# EAGLE design Motor_Test_Bench_ONE_LAYER (EAGLE 9.5.0)
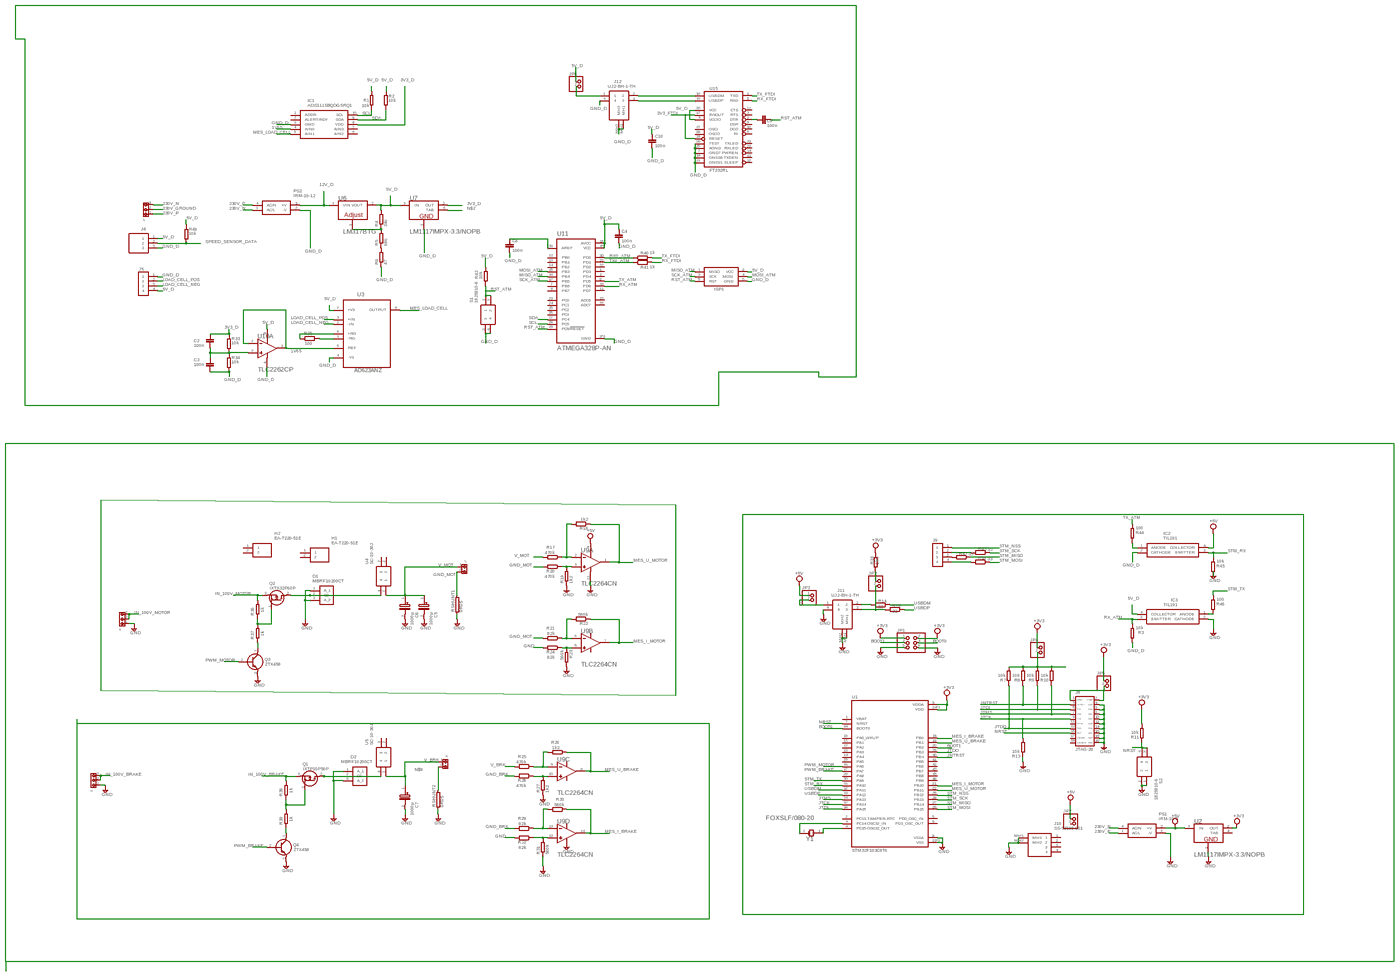
[diagram p0: schematic, sheet 1, overview]
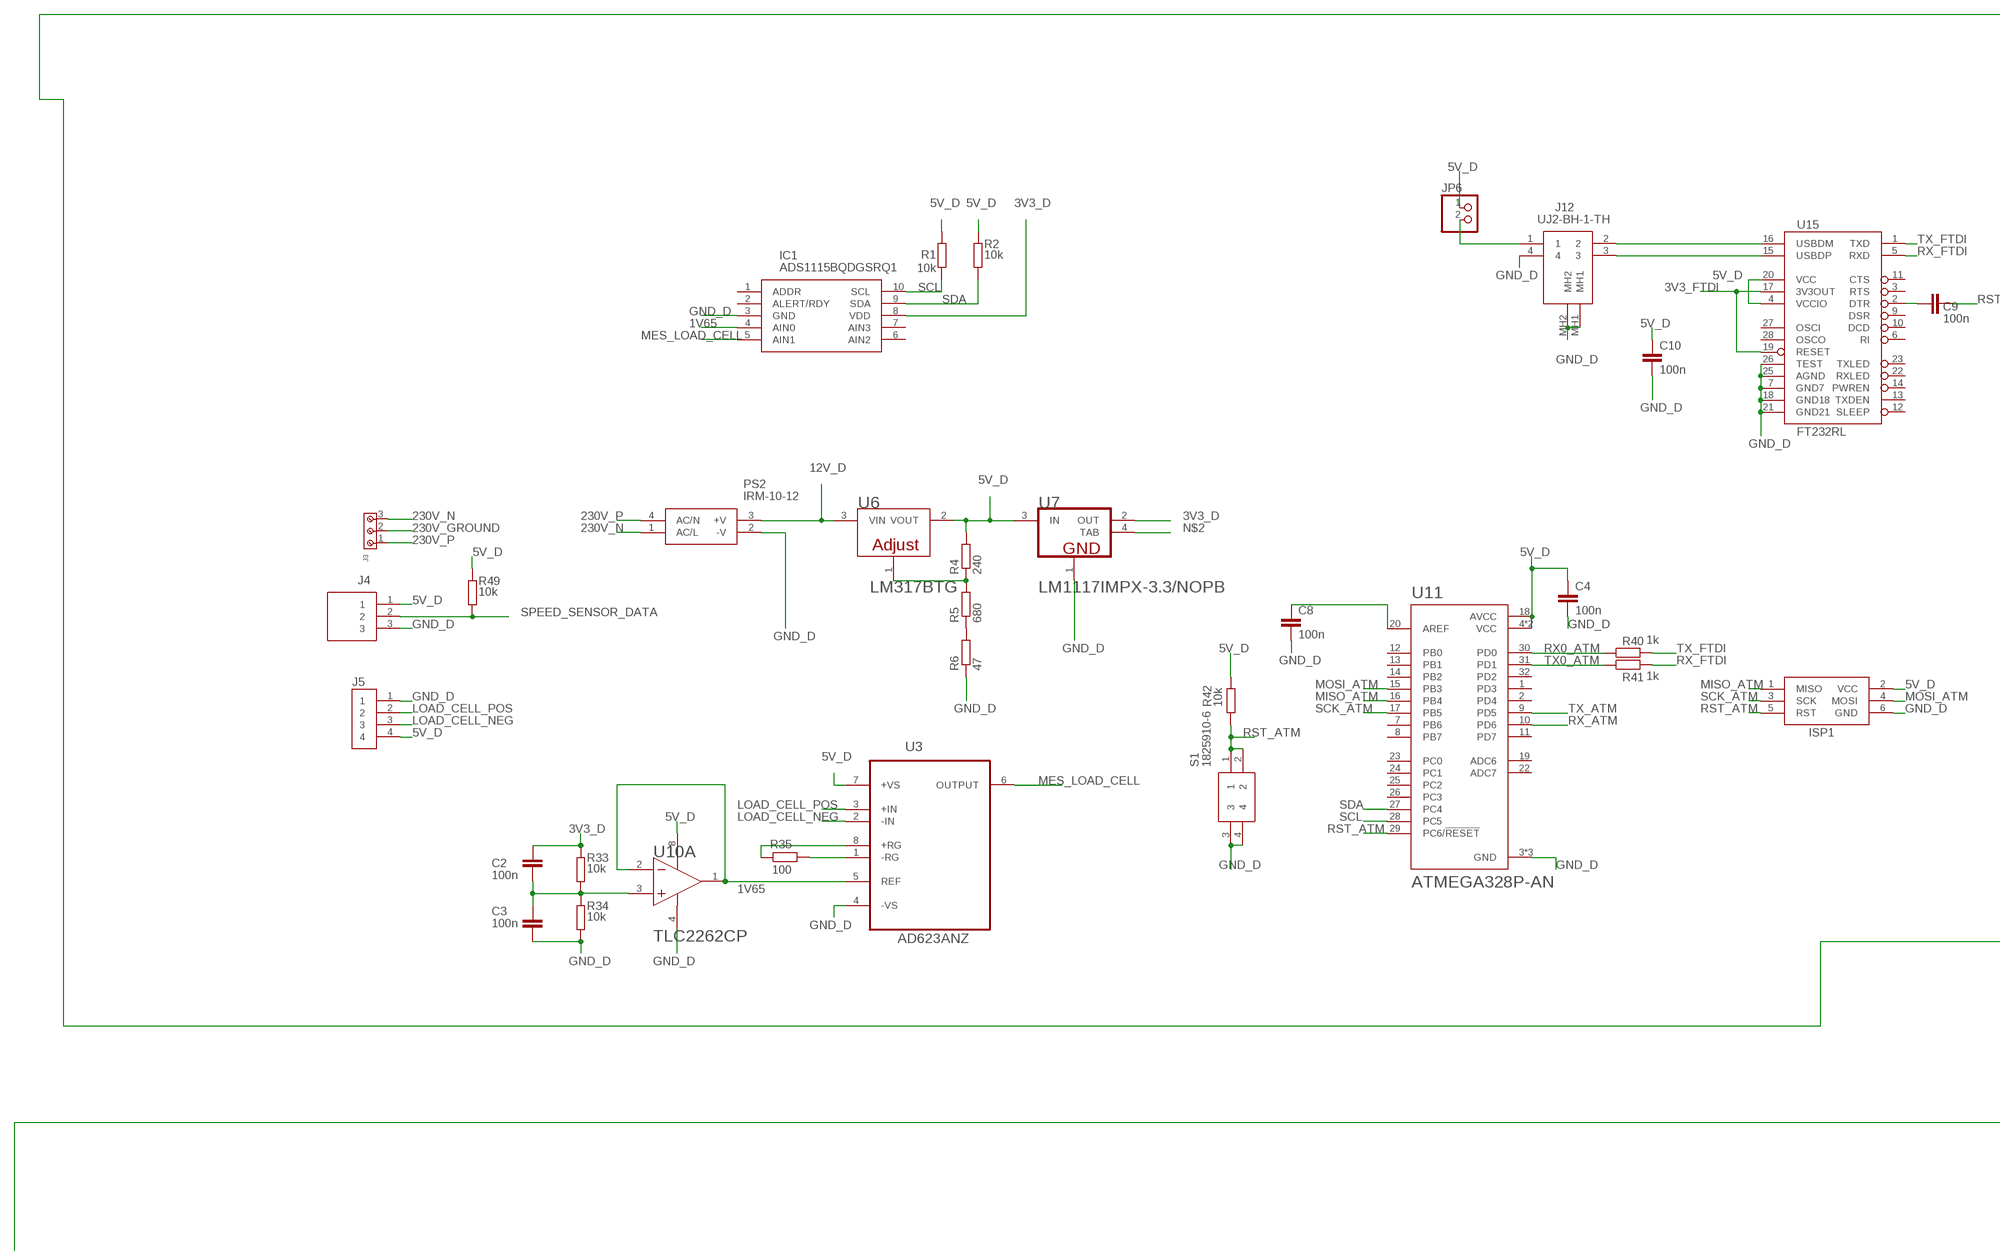
[diagram p1: schematic, sheet 1, part 1 of 4]
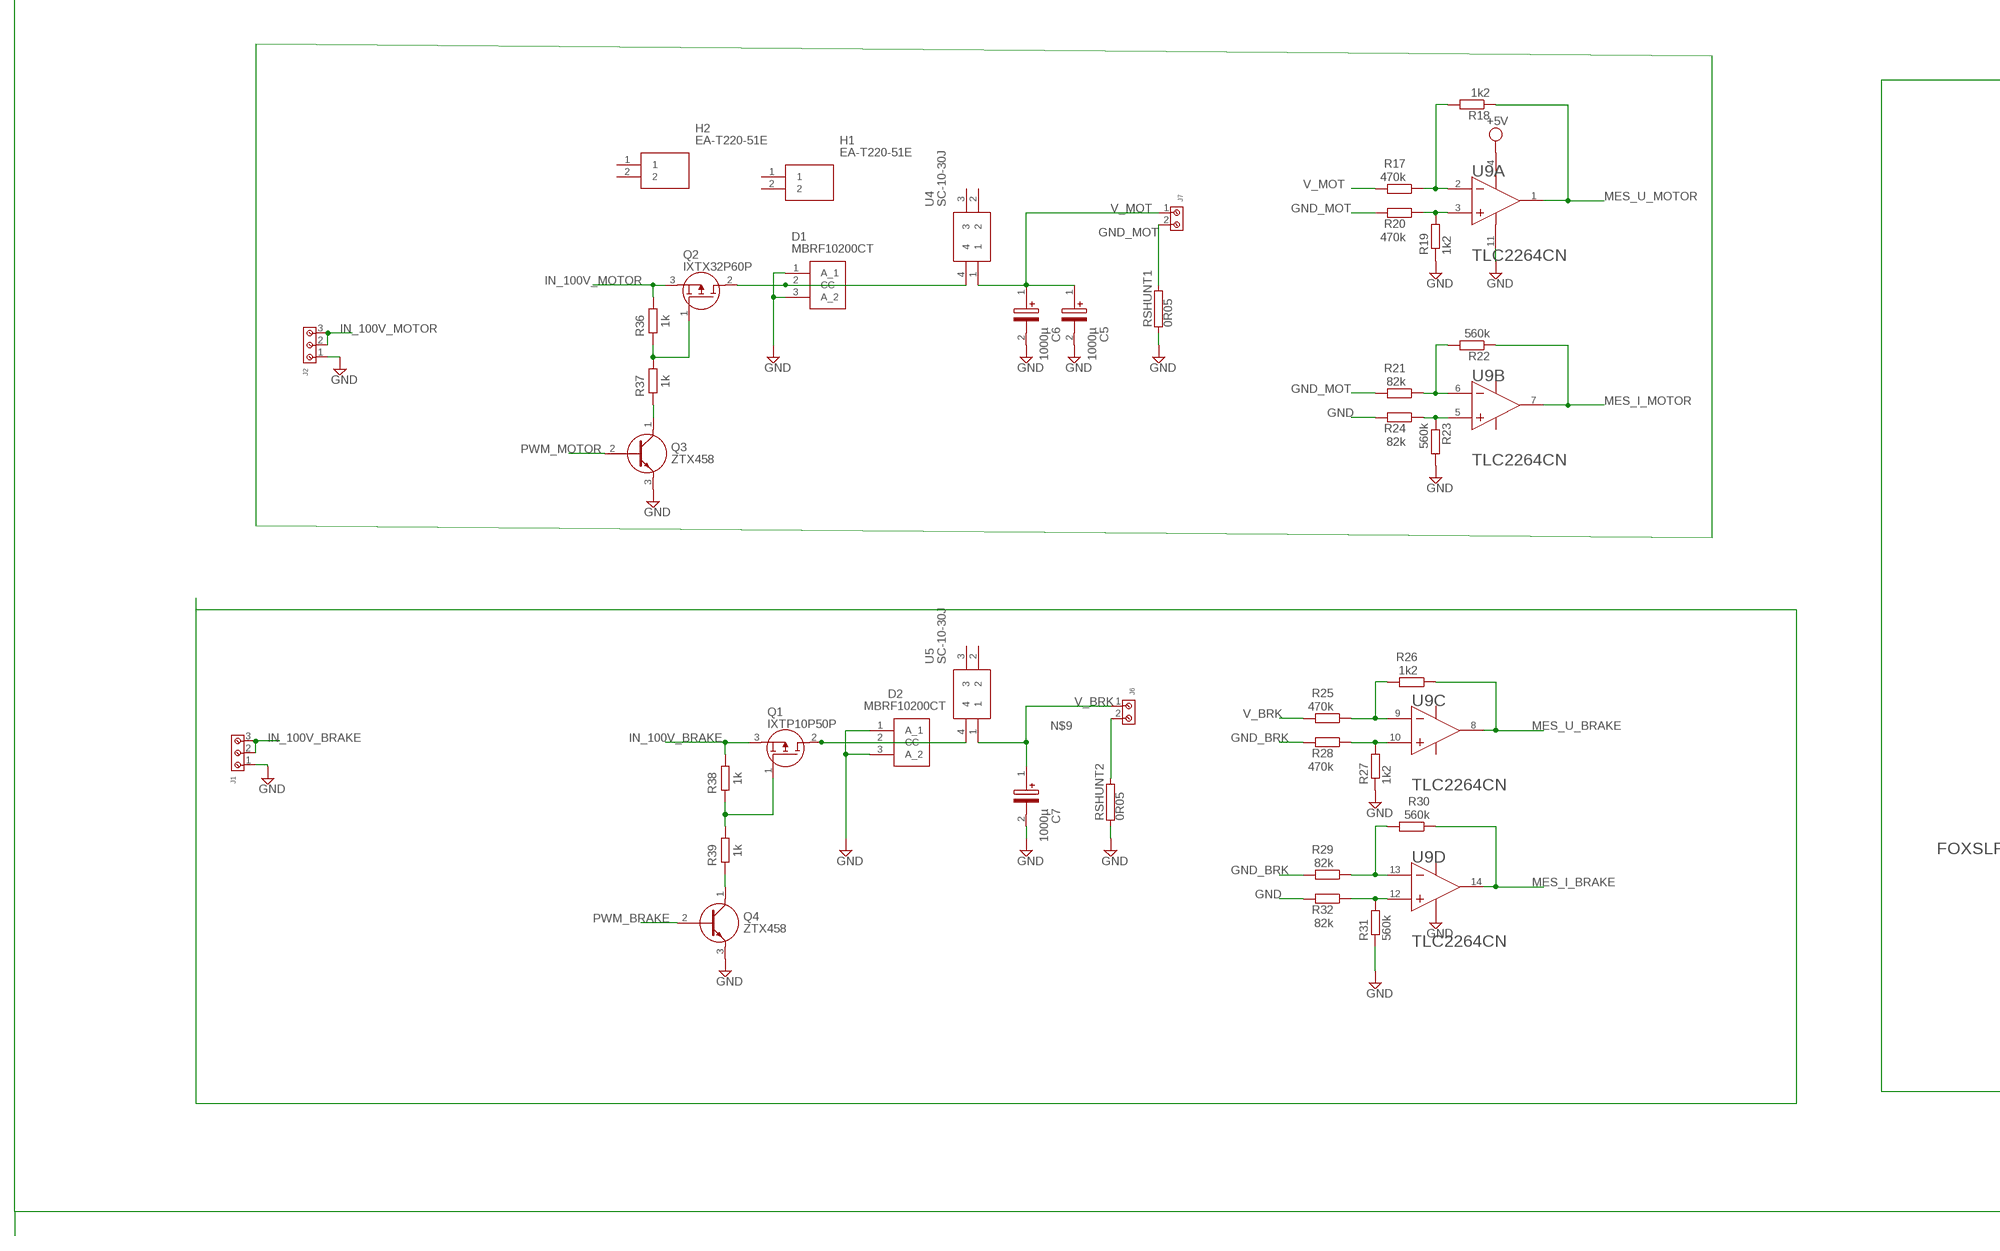
[diagram p2: schematic, sheet 1, part 2 of 4]
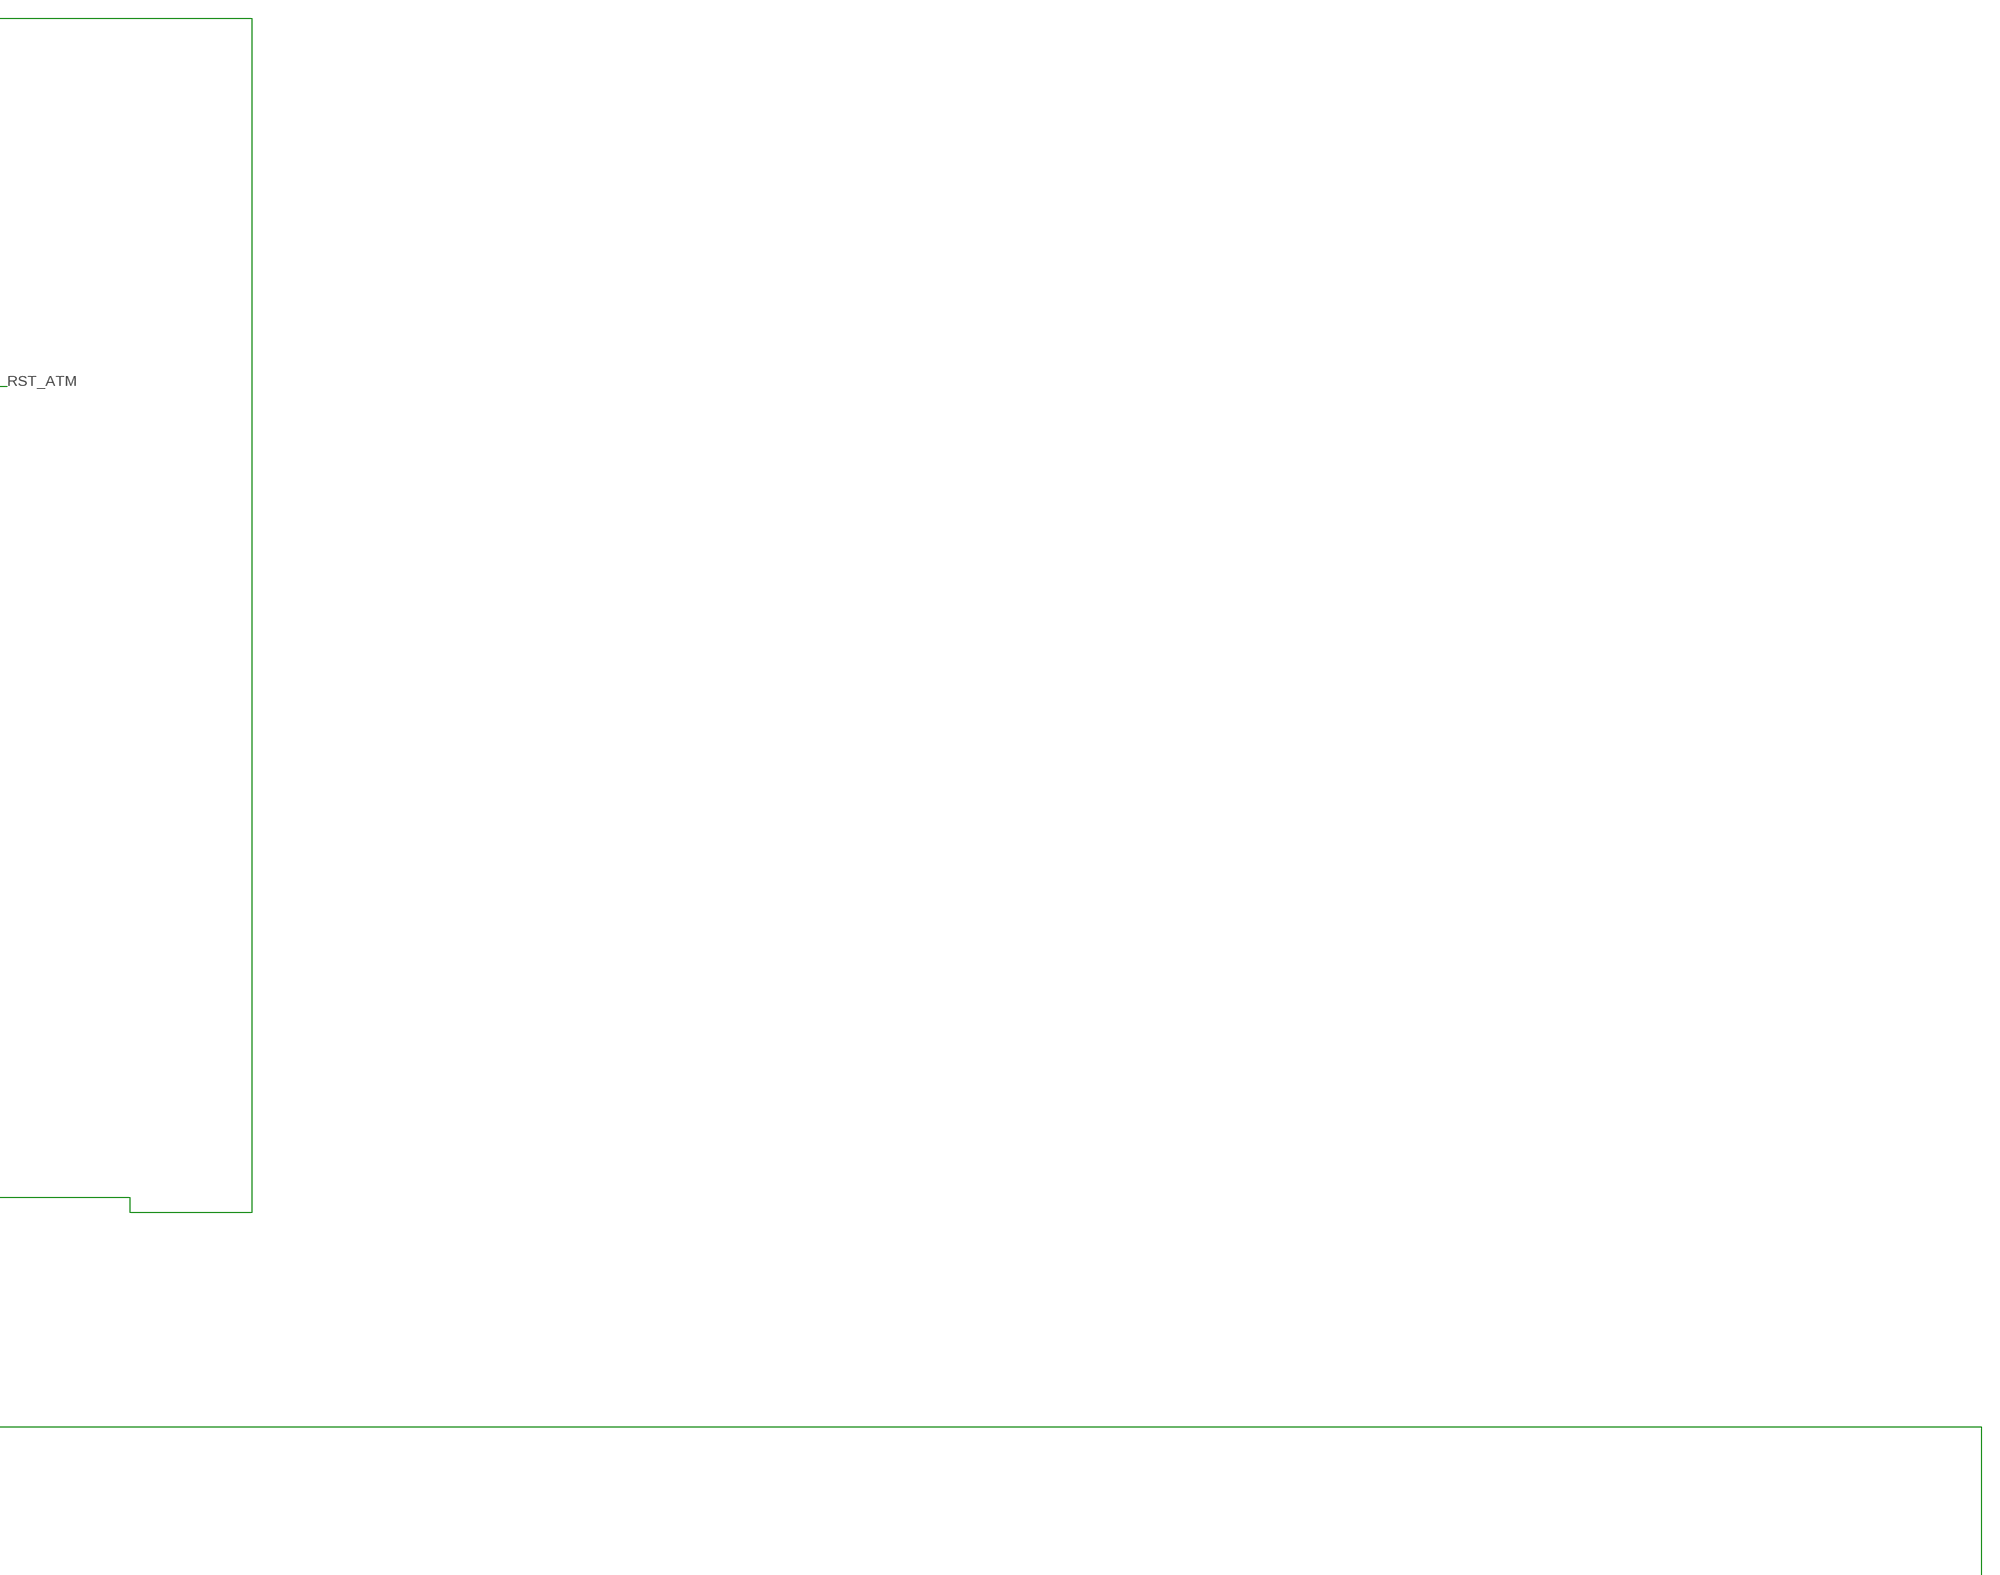
[diagram p3: schematic, sheet 1, part 3 of 4]
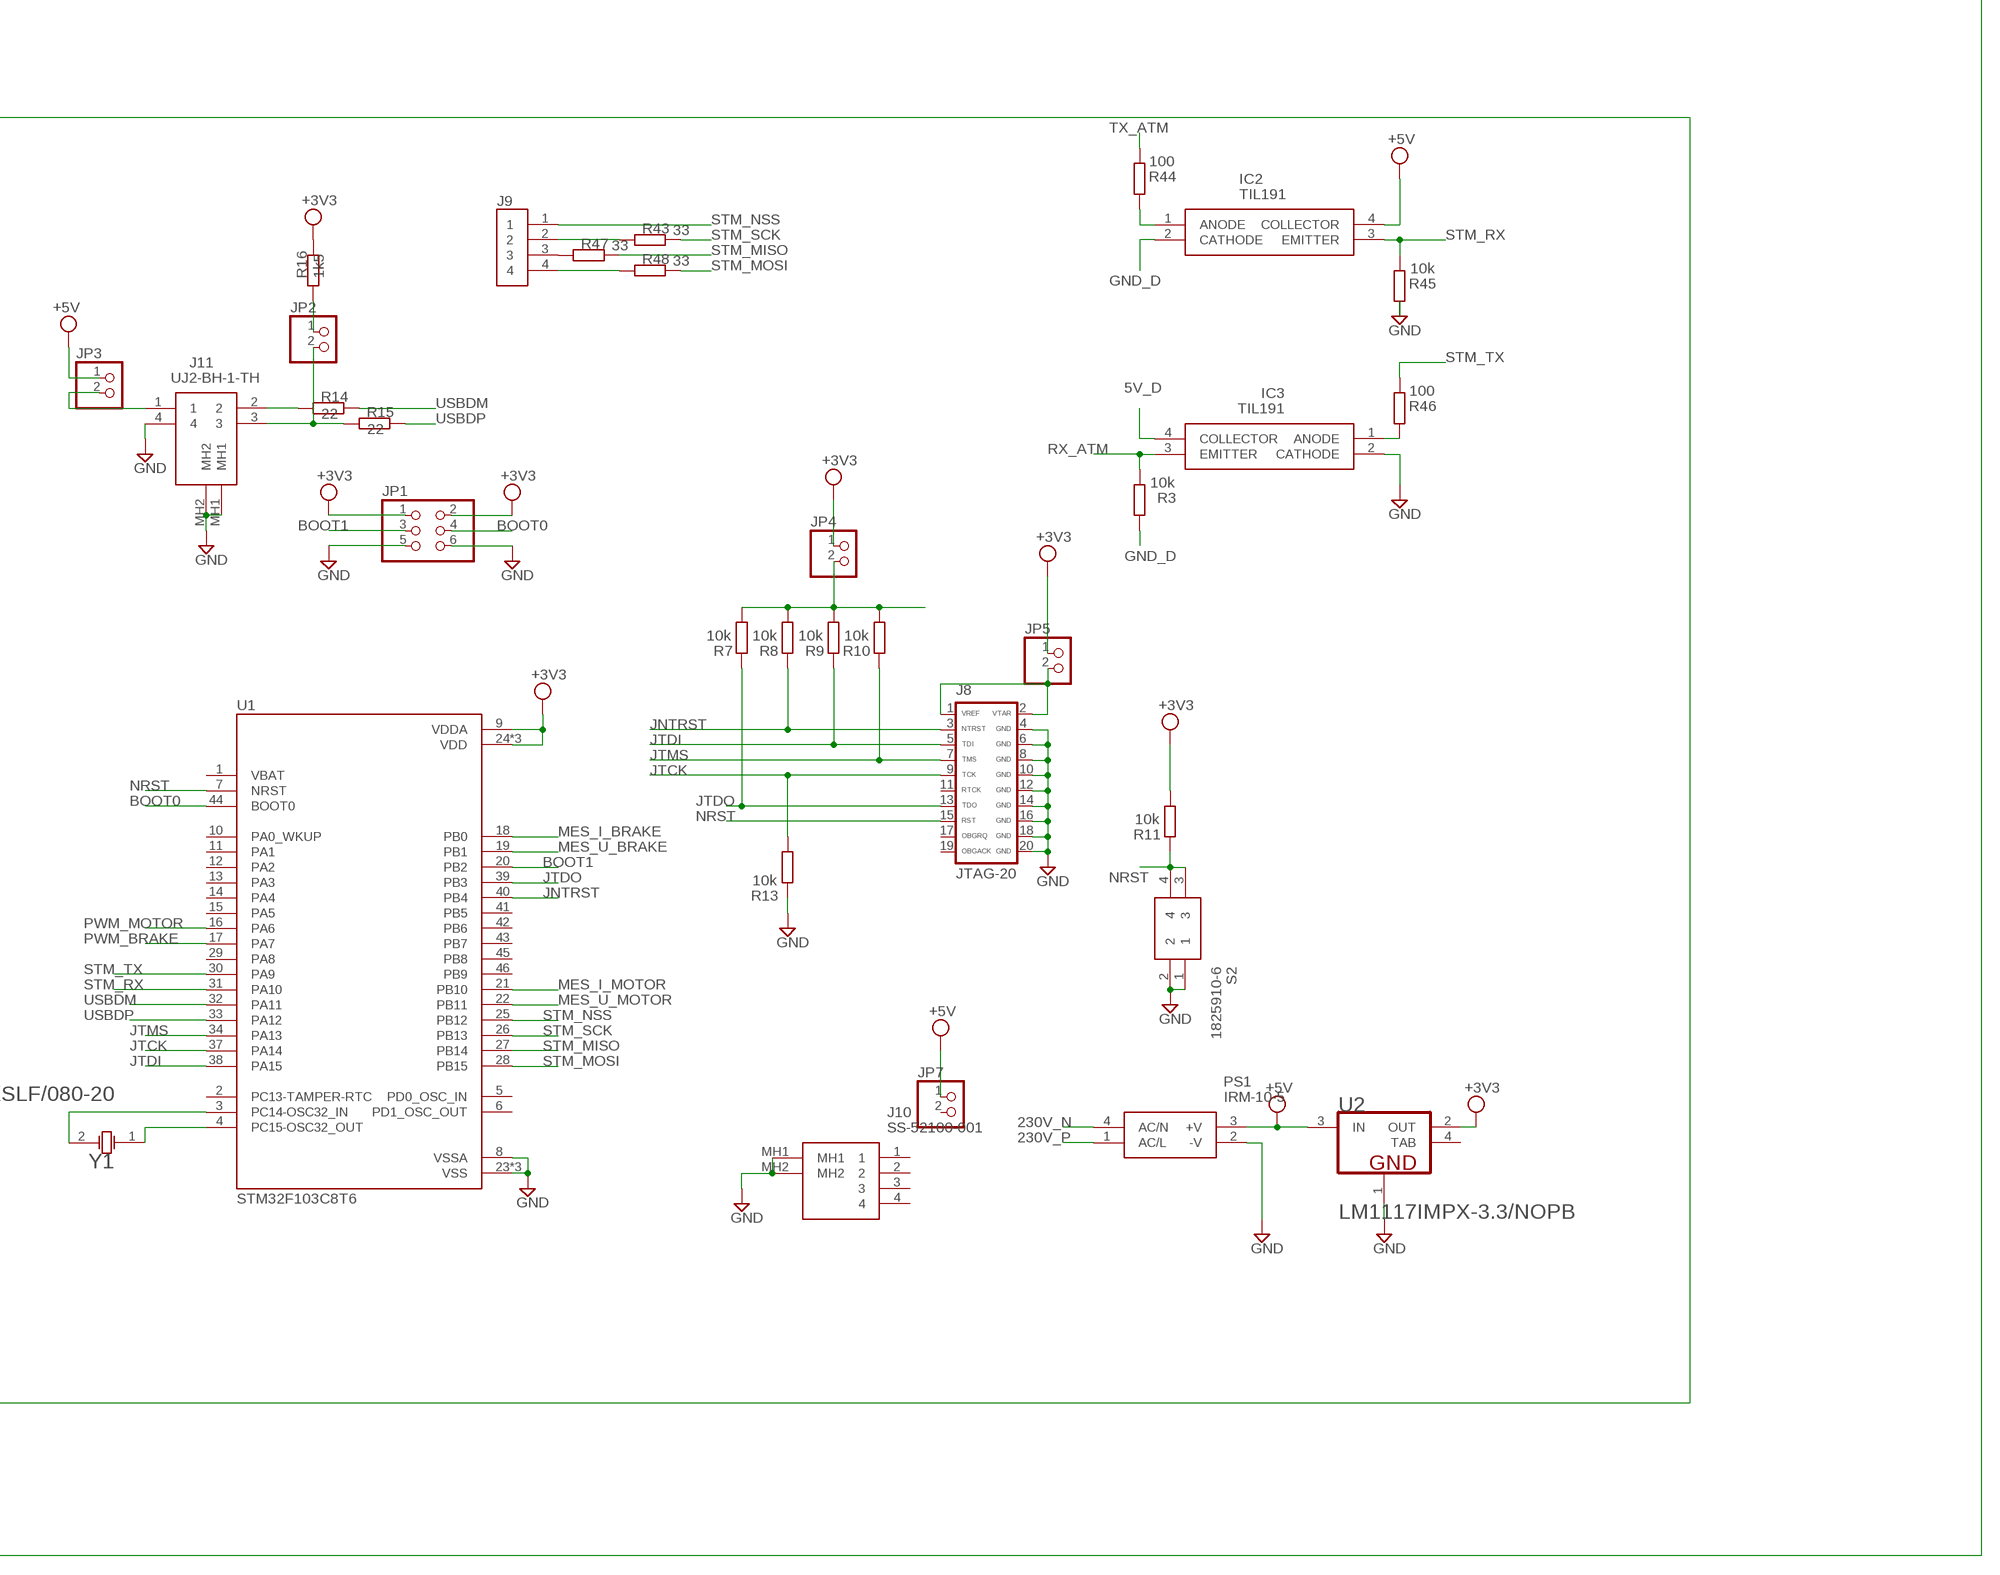
[diagram p4: schematic, sheet 1, part 4 of 4]

## Parts
C2  100n  C-EUC0805  [C0805]
C3  100n  C-EUC0805  [C0805]
C4  100n  CC0805KRX7R9BB104  [CAP_0805]
C5  1000µ  SLPX102M200C4P3  [SLPX102M200C4P3]
C6  1000µ  SLPX102M200C4P3  [SLPX102M200C4P3]
C7  1000µ  SLPX102M200C4P3  [SLPX102M200C4P3]
C8  100n  CC0805KRX7R9BB104  [CAP_0805]
C9  100n  CC0805KRX7R9BB104  [CAP_0805]
C10  100n  CC0805KRX7R9BB104  [CAP_0805]
D1  MBRF10200CT  [TO254P490X1000X2143-3P]
D2  MBRF10200CT  [TO254P490X1000X2143-3P]
H1  EA-T220-51E  [EAT22051E]
H2  EA-T220-51E  [EAT22051E]
IC1  ADS1115BQDGSRQ1  [SOP50P490X110-10N]
IC2  TIL191  [DIP762W58P254L450H584Q4N]
IC3  TIL191  [DIP762W58P254L450H584Q4N]
ISP1  AVRISP-6  [AVRISP]
J1  691210910003  [691210910003]
J2  691210910003  [691210910003]
J3  691210910003  [691210910003]
J4  B3B-XH-A(LF)(SN)  [SHDR3W64P0X250_1X3_990X575X700]
J5  B4B-XH-A(LF)(SN)  [JST_B4B-XH-A(LF)(SN)]
J6  691210910002  [691210910002]
J7  691210910002  [691210910002]
J8  JTAG-20  [JTAG-20]
J9  B4B-XH-A(LF)(SN)  [JST_B4B-XH-A(LF)(SN)]
J10  SS-52100-001  [SS52100001]
J11  UJ2-BH-1-TH  [UJ2BH1TH]
J12  UJ2-BH-1-TH  [UJ2BH1TH]
JP1  PINHD-2X3  [2X03]
JP2  PINHD-1X2  [1X02]
JP3  PINHD-1X2  [1X02]
JP4  PINHD-1X2  [1X02]
JP5  PINHD-1X2  [1X02]
JP6  PINHD-1X2  [1X02]
JP7  PINHD-1X2  [1X02]
PS1  IRM-10-5  [IRM-10]
PS2  IRM-10-12  [IRM-10]
Q1  IXTP10P50P  [TO254P483X1028X1700-3P]
Q2  IXTX32P60P  [TO545P521X1594X2566-3P]
Q3  ZTX458  [ZTX458]
Q4  ZTX458  [ZTX458]
R1  10k  R-EU_R0805  [R0805]
R2  10k  R-EU_R0805  [R0805]
R3  10k  R-EU_R0805  [R0805]
R4  240  R-EU_R0805  [R0805]
R5  680  R-EU_R0805  [R0805]
R6  47  R-EU_R0805  [R0805]
R7  10k  R-EU_R0805  [R0805]
R8  10k  R-EU_R0805  [R0805]
R9  10k  R-EU_R0805  [R0805]
R10  10k  R-EU_R0805  [R0805]
R11  10k  R-EU_R0805  [R0805]
R13  10k  R-EU_R0805  [R0805]
R14  22  R-EU_R0805  [R0805]
R15  22  R-EU_R0805  [R0805]
R16  1k5  R-EU_R0805  [R0805]
R17  470k  R-EU_R0805  [R0805]
R18  1k2  R-EU_R0805  [R0805]
R19  1k2  R-EU_R0805  [R0805]
R20  470k  R-EU_R0805  [R0805]
R21  82k  R-EU_R0805  [R0805]
R22  560k  R-EU_R0805  [R0805]
R23  560k  R-EU_R0805  [R0805]
R24  82k  R-EU_R0805  [R0805]
R25  470k  R-EU_R0805  [R0805]
R26  1k2  R-EU_R0805  [R0805]
R27  1k2  R-EU_R0805  [R0805]
R28  470k  R-EU_R0805  [R0805]
R29  82k  R-EU_R0805  [R0805]
R30  560k  R-EU_R0805  [R0805]
R31  560k  R-EU_R0805  [R0805]
R32  82k  R-EU_R0805  [R0805]
R33  10k  R-EU_R0805  [R0805]
R34  10k  R-EU_R0805  [R0805]
R35  100  R-EU_R0805  [R0805]
R36  1k  R-EU_R0805  [R0805]
R37  1k  R-EU_R0805  [R0805]
R38  1k  R-EU_R0805  [R0805]
R39  1k  R-EU_R0805  [R0805]
R40  1k  R-EU_R0805  [R0805]
R41  1k  R-EU_R0805  [R0805]
R42  10k  R-EU_R0805  [R0805]
R43  33  R-EU_R0805  [R0805]
R44  100  R-EU_R0805  [R0805]
R45  10k  R-EU_R0805  [R0805]
R46  100  R-EU_R0805  [R0805]
R47  33  R-EU_R0805  [R0805]
R48  33  R-EU_R0805  [R0805]
R49  10k  R-EU_R0805  [R0805]
RSHUNT1  0R05  RRS05_69-70  [RS05_69-70]
RSHUNT2  0R05  RRS05_69-70  [RS05_69-70]
S1  1825910-6  [1825910-6]
S2  1825910-6  [1825910-6]
U1  STM32F103C8T6  [QFP50P900X900X160-48N]
U2  NATIONAL_SEMICONDUCTOR_LM1117IMPX-3.3-NOPBNATIONAL_SEMICONDUCTOR_LM1117IMPX-3.3-NOPB_0_2  [NATIONAL_SEMICONDUCTOR_LM1117IMPX-3.3-NOPB_2]
U3  AD623ANZ  [DIP254P762X533-8]
U4  SC-10-30J  [SC-10-30J]
U5  SC-10-30J  [SC-10-30J]
U6  ON_SEMI_LM317BTGON_SEMI_LM317BTG_0_0  [ON_SEMI_LM317BTG_0]
U7  NATIONAL_SEMICONDUCTOR_LM1117IMPX-3.3-NOPBNATIONAL_SEMICONDUCTOR_LM1117IMPX-3.3-NOPB_0_2  [NATIONAL_SEMICONDUCTOR_LM1117IMPX-3.3-NOPB_2]
U9  TEXAS_INSTRUMENTS_TLC2264CNTEXAS_INSTRUMENTS_TLC2264CN_0_0  [TEXAS_INSTRUMENTS_TLC2264CN_0]
U10  TEXAS_INSTRUMENTS_TLC2262CPTEXAS_INSTRUMENTS_TLC2262CP_0_0  [TEXAS_INSTRUMENTS_TLC2262CP_0]
U11  ATMEGA328P-AN  [QFP80P900X900X120-32N]
U15  FT232RL  FT232RLSSOP  [SSOP28DB]
Y1  FOX_ELECTRONICS_FOXSLF-080-20FOX_ELECTRONICS_FOXSLF-080-20_0_0  [FOX_ELECTRONICS_FOXSLF-080-20_0]

## Nets
1V65: IC1.4(AIN0) U3.5(REF) U10.1(A:OUT1) U10.2(A:IN1-)
3V3_D: C2.1 IC1.8(VDD) R33.1 U7.2(OUT)
3V3_FTDI: U15.17(3V3OUT) U15.19(RESET)
5V_D: C4.1 C10.1 IC3.4(COLLECTOR) ISP1.2(VCC) J4.1 J5.4 JP6.1 R1.2 R2.2 R4.2 R42.2 R49.1 U3.7(+VS) U6.2(VOUT) U7.3(IN) U10.8(A:VDD+) U11.4(VCC) U11.6(VCC) U11.18(AVCC) U15.4(VCCIO) U15.20(VCC)
12V_D: PS2.3(+V) U6.3(VIN)
230V_GROUND: J3.2
230V_N: J3.3 PS1.4(AC/N) PS2.1(AC/L)
230V_P: J3.1 PS1.1(AC/L) PS2.4(AC/N)
+3V3: JP1.1 JP1.2 JP4.1 JP5.1 R11.2 R16.1 U1.9(VDDA) U1.24(VDD) U1.36(VDD) U1.48(VDD) U2.2(OUT)
+5V: IC2.4(COLLECTOR) JP3.1 JP7.1 PS1.3(+V) U2.3(IN) U9.4(A:VDD+)
BOOT0: JP1.4 U1.44(BOOT0)
BOOT1: JP1.3 U1.20(PB2)
GND: C5.2(-) C6.2(-) C7.2(-) D1.1(A_1) D1.3(A_2) D2.1(A_1) D2.3(A_2) IC3.2(CATHODE) J1.1 J2.1 J8.4(GND) J8.6(GND) J8.8(GND) J8.10(GND) J8.12(GND) J8.14(GND) J8.16(GND) J8.18(GND) J8.20(GND) J10.MH1 J10.MH2 J11.4 J11.MH1 J11.MH2 JP1.5 JP1.6 PS1.2(-V) Q3.3(C) Q4.3(C) R13.1 R19.1 R23.2 R24.2 R27.1 R31.1 R32.2 R45.1 RSHUNT1.1 RSHUNT2.1 S2.1 S2.2 U1.8(VSSA) U1.23(VSS) U1.35(VSS) U1.47(VSS) U2.1(GND) U9.11(A:VDD-/GND)
GND_BRK: R28.2 R29.2
GND_D: C3.2 C4.2 C8.2 C10.2 IC1.3(GND) IC2.2(CATHODE) ISP1.6(GND) J4.3 J5.1 J12.4 J12.MH1 J12.MH2 PS2.2(-V) R3.1 R6.1 R34.2 S1.3 S1.4 U3.4(-VS) U7.1(GND) U10.4(A:VDD-/GND) U11.3(GND) U11.5(GND) U11.21(GND) U15.7(GND7) U15.18(GND18) U15.21(GND21) U15.25(AGND) U15.26(TEST)
GND_MOT: J7.2 R20.2 R21.2 RSHUNT1.2
IN_100V_BRAKE: J1.2 J1.3 Q1.3(S) R38.2
IN_100V_MOTOR: J2.2 J2.3 Q2.3(S) R36.2
JNTRST: J8.3(NTRST) R8.1 U1.40(PB4)
JTCK: J8.9(TCK) R13.2 U1.37(PA14)
JTDI: J8.5(TDI) R9.1 U1.38(PA15)
JTDO: J8.13(TDO) R7.1 U1.39(PB3)
JTMS: J8.7(TMS) R10.1 U1.34(PA13)
LOAD_CELL_NEG: J5.3 U3.2(-IN)
LOAD_CELL_POS: J5.2 U3.3(+IN)
MES_I_BRAKE: R30.1 U1.18(PB0) U9.14(D:OUT4)
MES_I_MOTOR: R22.1 U1.21(PB10) U9.7(B:OUT2)
MES_LOAD_CELL: IC1.5(AIN1) U3.6(OUTPUT)
MES_U_BRAKE: R26.1 U1.19(PB1) U9.8(C:OUT3)
MES_U_MOTOR: R18.1 U1.22(PB11) U9.1(A:OUT1)
MISO_ATM: ISP1.1(MISO) U11.16(PB4)
MOSI_ATM: ISP1.4(MOSI) U11.15(PB3)
N$1: D1.2(CC) Q2.2(D) U4.4
N$2: U7.4(TAB)
N$3: R5.1 R6.2
N$5: R4.1 R5.2 U6.1(ADJUST)
N$6: J11.2 R14.2
N$7: J11.3 JP2.2 R15.2
N$8: JP2.1 R16.2
N$9: J6.2 RSHUNT2.2
N$10: Q2.1(G) R36.1 R37.2
N$11: Q3.1(E) R37.1
N$12: R17.1 R18.2 U9.2(A:IN1-)
N$13: R19.2 R20.1 U9.3(A:IN1+)
N$14: C9.2 U15.2(DTR)
N$15: C8.1 U11.20(AREF)
N$16: Q1.1(G) R38.1 R39.2
N$17: R21.1 R22.2 U9.6(B:IN2-)
N$18: R23.1 R24.1 U9.5(B:IN2+)
N$19: R27.2 R28.1 U9.10(C:IN3+)
N$20: R25.1 R26.2 U9.9(C:IN3-)
N$21: R29.1 R30.2 U9.13(D:IN4-)
N$22: Q4.1(E) R39.1
N$23: R31.2 R32.1 U9.12(D:IN4+)
N$25: J12.2 U15.16(USBDM)
N$26: R35.2 U3.1(-RG)
N$27: C2.2 C3.1 R33.2 R34.1 U10.3(A:IN1+)
N$28: R35.1 U3.8(+RG)
N$29: J12.3 U15.15(USBDP)
N$32: D2.2(CC) Q1.2(D) U5.4
N$34: IC2.1(ANODE) R44.1
N$35: IC3.1(ANODE) R46.1
N$36: J11.1 JP3.2
N$37: J8.1(VREF) J8.2(VTAR) JP5.2
N$38: JP4.2 R7.2 R8.2 R9.2 R10.2
N$39: J12.1 JP6.2
N$40: J9.2 R43.2
N$41: J9.3 R47.2
N$42: J9.4 R48.2
N$43: U1.4(PC15-OSC32_OUT) Y1.1
N$44: U1.3(PC14-OSC32_IN) Y1.2
NRST: J8.15(RST) R11.1 S2.3 S2.4 U1.7(NRST)
PWM_BRAKE: Q4.2(B) U1.17(PA7)
PWM_MOTOR: Q3.2(B) U1.16(PA6)
RST_ATM: C9.1 ISP1.5(RST) R42.1 S1.1 S1.2 U11.29(PC6/!RESET)
RX0_ATM: R40.1 U11.30(PD0)
RX_ATM: IC3.3(EMITTER) R3.2 U11.10(PD6)
RX_FTDI: R41.2 U15.5(RXD)
SCK_ATM: ISP1.3(SCK) U11.17(PB5)
SCL: IC1.10(SCL) R1.1 U11.28(PC5)
SDA: IC1.9(SDA) R2.1 U11.27(PC4)
SPEED_SENSOR_DATA: J4.2 R49.2
STM_MISO: R47.1 U1.27(PB14)
STM_MOSI: R48.1 U1.28(PB15)
STM_NSS: J9.1 U1.25(PB12)
STM_RX: IC2.3(EMITTER) R45.2 U1.31(PA10)
STM_SCK: R43.1 U1.26(PB13)
STM_TX: R46.2 U1.30(PA9)
TX0_ATM: R41.1 U11.31(PD1)
TX_ATM: R44.2 U11.9(PD5)
TX_FTDI: R40.2 U15.1(TXD)
USBDM: R14.1 U1.32(PA11)
USBDP: R15.1 U1.33(PA12)
V_BRK: C7.1(+) J6.1 R25.2 U5.1
V_MOT: C5.1(+) C6.1(+) J7.1 R17.2 U4.1
Unconnected: H1.1 H1.2 H2.1 H2.2 IC1.1(ADDR) IC1.2(ALERT/RDY) IC1.6(AIN2) IC1.7(AIN3) J8.11(RTCK) J8.17(OBGRQ) J8.19(OBGACK) J10.1 J10.2 J10.3 J10.4 JP7.2 U1.1(VBAT) U1.2(PC13-TAMPER-RTC) U1.5(PD0_OSC_IN) U1.6(PD1_OSC_OUT) U1.10(PA0_WKUP) U1.11(PA1) U1.12(PA2) U1.13(PA3) U1.14(PA4) U1.15(PA5) U1.29(PA8) U1.41(PB5) U1.42(PB6) U1.43(PB7) U1.45(PB8) U1.46(PB9) U4.2 U4.3 U5.2 U5.3 U10.5(B:IN2+) U10.6(B:IN2-) U10.7(B:OUT2) U11.1(PD3) U11.2(PD4) U11.7(PB6) U11.8(PB7) U11.11(PD7) U11.12(PB0) U11.13(PB1) U11.14(PB2) U11.19(ADC6) U11.22(ADC7) U11.23(PC0) U11.24(PC1) U11.25(PC2) U11.26(PC3) U11.32(PD2) U15.3(RTS) U15.6(RI) U15.9(DSR) U15.10(DCD) U15.11(CTS) U15.12(SLEEP) U15.13(TXDEN) U15.14(PWREN) U15.22(RXLED) U15.23(TXLED) U15.27(OSCI) U15.28(OSCO)

## Power pins joined to a net without a drawn wire
TAB: U2.4(TAB)

## Library data of the parts
C2 C3 = resistor:C-EU: CAPACITOR, European symbol
C4 C8-C10 = Resistor_Capacitor:CC0805KRX7R9BB104: CAP CER 0.1UF 50V X7R 0805 Manufacturer's datasheet <http://www.yageo.com/documents/recent/UPY-GPHC_X7R_6.3V-to-50V_18.pdf>; CREATED_BY: PCBLayout.com; DIGIKEY_PART_NUMBER: 311-1140-2-ND; MANUFACTURER: Yageo; MPN: CC0805KRX7R9BB104; PACKAGE: SMD 0805
C5-C7 = SamacSys_Parts:SLPX102M200C4P3: Cornell-Dubilier 1000uF Electrolytic Capacitor 200V dc Through Hole - SLPX102M200C4P3 Source: Datasheet <http://uk.rs-online.com/web/p/products/7441199P>; DESCRIPTION: Cornell-Dubilier 1000uF Electrolytic Capacitor 200V dc Through Hole - SLPX102M200C4P3; HEIGHT: 47mm; MANUFACTURER_NAME: Cornell Dubilier; MANUFACTURER_PART_NUMBER: SLPX102M200C4P3; RS_PART_NUMBER: 7441199P; RS_PRICE-STOCK: http://uk.rs-online.com/web/p/products/7441199P
D1 D2 = SamacSys_Parts:MBRF10200CT: DIODE SCHOTTKY 5A ITO220AB Source: Datasheet <https://componentsearchengine.com/Datasheets/1/MBRF10200CT.pdf>; DESCRIPTION: DIODE SCHOTTKY 5A ITO220AB; HEIGHT: 4.9mm; MANUFACTURER_NAME: Diodes Inc.; MANUFACTURER_PART_NUMBER: MBRF10200CT; MOUSER_PART_NUMBER: 621-MBRF10200CT; MOUSER_PRICE-STOCK: https://www.mouser.com/Search/Refine.aspx?Keyword=621-MBRF10200CT
H1 H2 = SamacSys_Parts:EA-T220-51E: OHMITE - EA-T220-51E - HEATSINK, TO-220, 50.8MM, BLACK Source: Datasheet <https://componentsearchengine.com/Datasheets/1/EA-T220-51E.pdf>; DESCRIPTION: OHMITE - EA-T220-51E - HEATSINK, TO-220, 50.8MM, BLACK; HEIGHT: 50mm; MANUFACTURER_NAME: Ohmite; MANUFACTURER_PART_NUMBER: EA-T220-51E; MOUSER_PART_NUMBER: 588-EA-T220-51E; MOUSER_PRICE-STOCK: https://www.mouser.com/Search/Refine.aspx?Keyword=588-EA-T220-51E
IC1 = SamacSys_Parts:ADS1115BQDGSRQ1: Automotive 16-Bit 860SPS 4-Ch Delta-Sigma ADC With PGA, Oscillator, VREF, Comparator, and I2C Source: Datasheet <http://www.ti.com/lit/gpn/ads1115-q1>; DESCRIPTION: Automotive 16-Bit 860SPS 4-Ch Delta-Sigma ADC With PGA, Oscillator, VREF, Comparator, and I2C; HEIGHT: 1.1mm; MANUFACTURER_NAME: Texas Instruments; MANUFACTURER_PART_NUMBER: ADS1115BQDGSRQ1; MOUSER_PART_NUMBER: 595-ADS1115BQDGSRQ1; MOUSER_PRICE-STOCK: https://www.mouser.com/Search/Refine.aspx?Keyword=595-ADS1115BQDGSRQ1
IC2 IC3 = SamacSys_Parts:TIL191: Optocoupler DC-IN 1-CH Transistor DC-OUT 4-Pin PDIP Source: Datasheet; DESCRIPTION: Optocoupler DC-IN 1-CH Transistor DC-OUT 4-Pin PDIP; HEIGHT: 5.84mm; MANUFACTURER_NAME: Isocom; MANUFACTURER_PART_NUMBER: TIL191
ISP1 = adafruit:AVRISP: AVR ISP HEADER Standard 6 pin header for AVR programming
J1-J3 = Wurth_Connectors_WR-TBL Rising Cage Clamp:691210910003: WR-TBL Serie 2109 - 2.54 mm Horiz. Entry KIND PROPERTIES Pitch 2.54 mm MATERIAL PROPERTIES Insulator Material PA66 Insulator Flammability Rating UL94 V-0 Insulator Color Green Contact Material Brass Contact Plating Copper over Zinc Terminal Screw Material Steel Terminal Screw Plating Zinc Wire Guard Material Brass GENERAL INFORMATION Operating Temperature -40 up to +105 °C Compliance Lead free / RoHS ELECTRICAL PROPERTIES IR cULus 6 A Working Voltage [cULus] 150 V (AC) Withstanding Voltage [cULus] 1300 V (AC) Contact Resistance [cULus] 20 mΩ MECHANICAL PROPERTIES Wire Strip Length 4 up to 5 (mm) Screw M1.6 Solid Wire Section (AWG) 30 to 18 (AWG) Solid Wire Section (Metric) 0.0509 to 0.823 (mm²) Stranded Wire Section (AWG) 30 to 18 (AWG) Stranded Wire Section (Metric) 0.0509 to 0.823 (mm²) CERTIFICATION cULus Approval E315414 PACKAGING PROPERTIES Packaging Box <https://katalog.we-online.com/media/images/v2/o33231v209%20Family_WR-TBL_69121091000x.jpg> Details see: https://katalog.we-online.com/en/em/TBL_2_54_2109_HORIZONTAL_ENTRY_69121091000X Updated by Ella Wu 2019-11-12 2019(C) Wurth Elektronik; DATASHEET-URL: https://www.we-online.com/catalog/datasheet/691210910003.pdf; IR-UL: 6A; MOUNT: THT; PART-NUMBER: 691210910003; PINS: 3; PITCH: 2.54mm; TYPE: Horizontal; WIRE: 30 to 18 (AWG) 0.0509 to 0.823 (mm²); WORKING-VOLTAGE-UL: 150V (AC)
J4 = SamacSys_Parts:B3B-XH-A(LF)(SN): XH-2.5mm Header top entry 3 way JST XH Series, Series Number B3B, 2.5mm Pitch 3 Way 1 Row Straight PCB Header, Solder Termination, 3A Source: Datasheet; DESCRIPTION: XH-2.5mm Header top entry 3 way JST XH Series, Series Number B3B, 2.5mm Pitch 3 Way 1 Row Straight PCB Header, Solder Termination, 3A; HEIGHT: 7mm; MANUFACTURER_NAME: JST (JAPAN SOLDERLESS TERMINALS); MANUFACTURER_PART_NUMBER: B3B-XH-A(LF)(SN)
J5 J9 = B4B-XH-A_LF__SN_:B4B-XH-A(LF)(SN): XH Series 4 Position 2.5 mm Pitch Through Hole Crimp Top Entry Shrouded Header; AVAILABILITY: Unavailable; DESCRIPTION: Connector Header Through Hole 4 position 0.098 _2.50mm_; MF: JST Sales; MP: B4B-XH-A_LF__SN_; PACKAGE: None; PRICE: None
J6 J7 = Wurth_Connectors_WR-TBL Rising Cage Clamp:691210910002: WR-TBL Serie 2109 - 2.54 mm Horiz. Entry KIND PROPERTIES Pitch 2.54 mm MATERIAL PROPERTIES Insulator Material PA66 Insulator Flammability Rating UL94 V-0 Insulator Color Green Contact Material Brass Contact Plating Copper over Zinc Terminal Screw Material Steel Terminal Screw Plating Zinc Wire Guard Material Brass GENERAL INFORMATION Operating Temperature -40 up to +105 °C Compliance Lead free / RoHS ELECTRICAL PROPERTIES IR cULus 6 A Working Voltage [cULus] 150 V (AC) Withstanding Voltage [cULus] 1300 V (AC) Contact Resistance [cULus] 20 mΩ MECHANICAL PROPERTIES Wire Strip Length 4 up to 5 (mm) Screw M1.6 Solid Wire Section (AWG) 30 to 18 (AWG) Solid Wire Section (Metric) 0.0509 to 0.823 (mm²) Stranded Wire Section (AWG) 30 to 18 (AWG) Stranded Wire Section (Metric) 0.0509 to 0.823 (mm²) CERTIFICATION cULus Approval E315414 PACKAGING PROPERTIES Packaging Box <https://katalog.we-online.com/media/images/v2/o33231v209%20Family_WR-TBL_69121091000x.jpg> Details see: https://katalog.we-online.com/en/em/TBL_2_54_2109_HORIZONTAL_ENTRY_69121091000X Updated by Ella Wu 2019-11-12 2019(C) Wurth Elektronik; DATASHEET-URL: https://www.we-online.com/catalog/datasheet/691210910002.pdf; IR-UL: 6A; MOUNT: THT; PART-NUMBER: 691210910002; PINS: 2; PITCH: 2.54mm; TYPE: Horizontal; WIRE: 30 to 18 (AWG) 0.0509 to 0.823 (mm²); WORKING-VOLTAGE-UL: 150V (AC)
J8 = luminary-arm:JTAG-20: JTAG 20-Pin Programming/Debug Connector
J10 = SamacSys_Parts:SS-52100-001: STEWART CONNECTOR - SS-52100-001 - USB CONN, 2.0 TYPE A, RCPT, 4POS, TH Source: Datasheet <https://componentsearchengine.com/Datasheets/1/SS-52100-001.pdf>; DESCRIPTION: STEWART CONNECTOR - SS-52100-001 - USB CONN, 2.0 TYPE A, RCPT, 4POS, TH; HEIGHT: 6.9mm; MANUFACTURER_NAME: Bel-Stewart; MANUFACTURER_PART_NUMBER: SS-52100-001; MOUSER_PART_NUMBER: 530-SS-52100-001; MOUSER_PRICE-STOCK: https://www.mouser.com/Search/Refine.aspx?Keyword=530-SS-52100-001
J11 J12 = SamacSys_Parts:UJ2-BH-1-TH: USB Connectors USB 2.0 type B jack 4 pin Horizontal TH Source: Datasheet <https://componentsearchengine.com/Datasheets/1/UJ2-BH-1-TH.pdf>; DESCRIPTION: USB Connectors USB 2.0 type B jack 4 pin Horizontal TH; HEIGHT: 10mm; MANUFACTURER_NAME: CUI Devices; MANUFACTURER_PART_NUMBER: UJ2-BH-1-TH; MOUSER_PART_NUMBER: 490-UJ2-BH-1-TH; MOUSER_PRICE-STOCK: https://www.mouser.com/Search/Refine.aspx?Keyword=490-UJ2-BH-1-TH
JP1 = pinhead:PINHD-2X3: PIN HEADER
JP2-JP7 = DC_LOAD_AU:PINHD-1X2: PIN HEADER
PS1 = SamacSys_Parts:IRM-10-5: AC/DC Power Modules 5V 2A 10W 85-264Vin Encap PS Source: Datasheet <http://uk.rs-online.com/web/p/products/1358929>; ALLIED_NUMBER: 70387823; DESCRIPTION: AC/DC Power Modules 5V 2A 10W 85-264Vin Encap PS; HEIGHT: mm; MANUFACTURER_NAME: Mean Well; MANUFACTURER_PART_NUMBER: IRM-10-5; RS_PART_NUMBER: 1358929; RS_PRICE-STOCK: http://uk.rs-online.com/web/p/products/1358929
PS2 = SamacSys_Parts:IRM-10-12: Power Supply Encapsulated PCB 12V 10W Source: Datasheet <http://uk.rs-online.com/web/p/products/1358930>; ALLIED_NUMBER: 70387819; DESCRIPTION: Power Supply Encapsulated PCB 12V 10W; HEIGHT: mm; MANUFACTURER_NAME: Mean Well; MANUFACTURER_PART_NUMBER: IRM-10-12; RS_PART_NUMBER: 1358930; RS_PRICE-STOCK: http://uk.rs-online.com/web/p/products/1358930
Q1 = SamacSys_Parts:IXTP10P50P: MOSFET -10.0 Amps -500V 1.000 Rds Source: Datasheet <https://componentsearchengine.com/Datasheets/1/IXTP10P50P.pdf>; DESCRIPTION: MOSFET -10.0 Amps -500V 1.000 Rds; HEIGHT: 4.83mm; MANUFACTURER_NAME: IXYS SEMICONDUCTOR; MANUFACTURER_PART_NUMBER: IXTP10P50P; MOUSER_PART_NUMBER: 747-IXTP10P50P; MOUSER_PRICE-STOCK: https://www.mouser.com/Search/Refine.aspx?Keyword=747-IXTP10P50P
Q2 = SamacSys_Parts:IXTX32P60P: MOSFET -32 Amps -600V 0.350 Rds Source: Datasheet <https://componentsearchengine.com/Datasheets/1/IXTX32P60P.pdf>; DESCRIPTION: MOSFET -32 Amps -600V 0.350 Rds; HEIGHT: 5.21mm; MANUFACTURER_NAME: IXYS SEMICONDUCTOR; MANUFACTURER_PART_NUMBER: IXTX32P60P; MOUSER_PART_NUMBER: 747-IXTX32P60P; MOUSER_PRICE-STOCK: https://www.mouser.com/Search/Refine.aspx?Keyword=747-IXTX32P60P
Q3 Q4 = SamacSys_Parts:ZTX458: Transistor,NPN,0.5A,400V,E-Line Source: Datasheet <https://componentsearchengine.com/Datasheets/1/ZTX458.pdf>; DESCRIPTION: Transistor,NPN,0.5A,400V,E-Line; HEIGHT: 4.01mm; MANUFACTURER_NAME: Diodes Inc.; MANUFACTURER_PART_NUMBER: ZTX458; MOUSER_PART_NUMBER: 522-ZTX458; MOUSER_PRICE-STOCK: https://www.mouser.com/Search/Refine.aspx?Keyword=522-ZTX458
R1-R11 R13-R49 = resistor:R-EU_: RESISTOR, European symbol
RSHUNT1 RSHUNT2 = resistor-power:R: Power Resitor; OC_FARNELL: unknown; OC_NEWARK: unknown
S1 S2 = SamacSys_Parts:1825910-6: TE CONNECTIVITY / ALCOSWITCH - 1825910-6 - TACT SWITCH, SPST, 0.05A, 24VDC, SOLDER Source: Datasheet; DESCRIPTION: TE CONNECTIVITY / ALCOSWITCH - 1825910-6 - TACT SWITCH, SPST, 0.05A, 24VDC, SOLDER; HEIGHT: mm; MANUFACTURER_NAME: TE Connectivity; MANUFACTURER_PART_NUMBER: 1825910-6; MOUSER_PART_NUMBER: N/A; MOUSER_PRICE-STOCK: https://www.mouser.com/Search/Refine.aspx?Keyword=N%2FA
U1 = STM32F103C8T6:STM32F103C8T6: Mainstream Performance line, ARM Cortex-M3 MCU with 64 Kbytes Flash, 72 MHz CPU, motor control, USB and CAN; AVAILABILITY: Unavailable; DESCRIPTION: ARM® Cortex®-M3 STM32F1 Microcontroller IC 32-Bit 72MHz 64KB _64K x 8_ FLASH; MF: STMicroelectronics; MP: STM32F103C8T6; PACKAGE: LQFP-48 STMicroelectronics; PRICE: None
U2 U7 = LM1117IMPX:NATIONAL_SEMICONDUCTOR_LM1117IMPX-3.3-NOPB: PM-REG-LM1086-SOT4; CIIVA_IDS: 1248290; CODE__IPC: SOT223-4; CODE__JEDEC: TO-261-AA; COMPONENT_LINK_1_DESCRIPTION: Manufacturer URL; COMPONENT_LINK_1_URL: http://www.national.com/; COMPONENT_LINK_2_DESCRIPTION: LM1117 Datasheet; COMPONENT_LINK_2_URL: http://www.national.com/ds/LM/LM1117.pdf; COMPONENT_LINK_3_DESCRIPTION: LM1117 Web Page; COMPONENT_LINK_3_URL: http://www.national.com/pf/LM/LM1117.html; COMPONENT_LINK_4_DESCRIPTION: MP04A Package Page; COMPONENT_LINK_4_URL: http://www.national.com/packaging/folders/mp04a.html; COMP_TYPE: LDO IC; DATASHEET_VERSION: Apr-2006; FOOTPRINT_VARIANT_NAME_0: Level C; FOOTPRINT_VARIANT_NAME_1: Level B; FOOTPRINT_VARIANT_NAME_2: Level A; HIGH__RELIABILITY: Y; IMPORTED: yes; IMPORTED_FROM: vault; IMPORT_TS: 1521844797; MF: National Semiconductor; MPN: LM1117IMPX-3.3/NOPB; PACKAGE: MP04A; PACKAGE_DESCRIPTION: Molded SOT-223, 6.50 x 3.56 x 1.6mm Body, 4 Lead, 2.3mm Pitch; PACKAGE_TOP_MARKING: XYTT*N05B; PACKAGE_VERSION: revB, Apr-2003; PIN_COUNT: 4; POWER_WISE: N; PREFIX: U; RELEASE_DATE: 1348562355; ROHS: Yes; VAULT_GUID: 5347B544-0EC6-4DDA-9FFD-45A5015DD418; VAULT_REVISION: 9ED12BCD-7A1F-4365-A91F-B783ED43257B
U3 = AD623ANZ:AD623ANZ: Single-Supply, Rail-to-Rail, Low Cost Instrumentation Amplifier; AVAILABILITY: Unavailable; DESCRIPTION: Instrumentation Amplifier 1 Circuit Rail-to-Rail 8-PDIP; MF: Analog Devices; MP: AD623ANZ; PACKAGE: PDIP-8 Analog Devices; PRICE: None
U4 U5 = SC-10-30J:SC-10-30J: Common Mode Choke THT AC 10A 3mH Source: Datasheet <http://www.kemet.com/docfinder?Partnumber=SC-10-30J>; DESCRIPTION: Common Mode Choke THT AC 10A 3mH; HEIGHT: mm; MANUFACTURER_NAME: Kemet; MANUFACTURER_PART_NUMBER: SC-10-30J; MOUSER_PART_NUMBER: 80-SC-10-30J; MOUSER_PRICE-STOCK: https://www.mouser.com/Search/Refine.aspx?Keyword=80-SC-10-30J; RS_PART_NUMBER: 8633778P; RS_PRICE-STOCK: http://uk.rs-online.com/web/p/products/8633778P
U6 = ON Semi - LM317BTG:ON_SEMI_LM317BTG: LDO Regulator Pos 1.2V to 37V 0.4A 3-Pin(3+Tab) TO-220 Rail; CENTROID_NOT_SPECIFIED: No; DATASHEET: http://www.onsemi.com/pub/Collateral/LM317-D.PDF; DEVICE_CLASS_L1: Integrated Circuits (ICs); DEVICE_CLASS_L2: Power Management ICs; DEVICE_CLASS_L3: Voltage Regulators - Linear; DIGIKEY_DESCRIPTION: IC REG LIN POS ADJ 1.5A TO220AB; DIGIKEY_PART_NUMBER: LM317BTGOS-ND; FOOTPRINT_PARAMETERS_0: {"fp_type":"TO220","params":{"N":{"long name":"Number of leads","type":"fixed","short name":"N","value":3},"A":{"nom":false,"long name":"Total height","min":14480000,"max":15750000,"short name":"A","type":"measurement"},"A1":{"nom":false,"long name":"Package clearance","min":2800000,"max":3930000,"short name":"A1","type":"measurement"},"D":{"nom":false,"long name":"Package length","min":9660000,"max":10280000,"short name":"D","type":"measurement"},"E":{"nom":false,"long name":"Package width","min":4070000,"max":4820000,"short name":"E","type":"measurement"},"B":{"nom":false,"long name":"Lead width","min":640000,"max":880000,"short name":"B","type":"measurement"},"C":{"nom":false,"long name":"Lead thickness","min":460000,"max":640000,"short name":"C","type":"measurement"},"e":{"nom":2540000,"long name":"Lead pitch","min":null,"max":null,"short name":"e","type":"measurement"},"offset x":{"nom":0,"long name":"X Center offset","min":null,"max":null,"short name":"offset x","type":"measurement"},"offset y":{"nom":0,"long name":"Y Center offset","min":null,"max":null,"short name":"offset y","type":"measurement"},"LS":{"default":"Circle","long name":"Land shape","type":"multichoice","short name":"LS"},"LS1":{"default":"Square","long name":"Land shape (Pin 1)","type":"multichoice","short name":"LS1"}}}; FOOTPRINT_URL: http://www.onsemi.com/pub/Collateral/221AB.PDF; HEIGHT: 15.75mm; IPC_LAND_PATTERN_NAME: TO-220; LEAD_FREE: yes; MAX_JUNCTION_TEMP: +150°C; MF: ON Semi; MFG_PACKAGE_IDENT: 221AB-01; MFG_PACKAGE_IDENT_DATE: 11/2010; MFG_PACKAGE_IDENT_REV: A; MOUSER_DESCRIPTION: Linear Voltage Regulators 1.5A ADJ 1.2-37V Positive; MOUSER_PART_NUMBER: 863-LM317BTG; MPN: LM317BTG; NUMBER_OF_OUTPUTS: 1; OUTPUT_CURRENT: 1.5A; OUTPUT_VOLTAGE: 1.2-37V; PACKAGE: TO-220-3; PREFIX: U; ROHS: yes; TEMPERATURE_RANGE_HIGH: +125°C; TEMPERATURE_RANGE_LOW: -40°C; VERIFICATION_VERSION: 0.0.0.1
U9 = Texas Instruments - TLC2264CN:TEXAS_INSTRUMENTS_TLC2264CN: TI-TLC_TLV-14; CIIVA_IDS: 13615389; CMRR_MIND_B: 70; CODE__JEDEC: MS-001; COMPONENT_LINK_1_DESCRIPTION: Manufacturer URL; COMPONENT_LINK_1_URL: http://www.ti.com/; COMPONENT_LINK_3_DESCRIPTION: Package Specification; COMPONENT_LINK_3_URL: http://www.ti.com/lit/ml/mpdi002c/mpdi002c.pdf; DATASHEET: http://www.ti.com/lit/ds/symlink/tlc2264.pdf; DATASHEET_VERSION: SLOS177D; ECO__PLAN: Pb-Free (RoHS); FOOTPRINT_VARIANT_NAME_0: Manufacturer Recommended; GBW_TYP_MHZ: 0.71; IIB_MAXP_A: 100; IMPORTED: yes; IMPORTED_FROM: vault; IMPORT_TS: 1521851278; IQ_PER_CHANNELMAXMA: 0.25; MF: Texas Instruments; MOUNTING_TECHNOLOGY: Through Hole; MPN: TLC2264CN; NUMBER_OF_CHANNELS: 4; OFFSET_DRIFTTYPUVC: 2; PACKAGE: N0014A; PACKAGE_DESCRIPTION: 14-Pin Plastic In-Line, Body 19.305 x 6.35 mm, Pitch 2.54 mm; PACKAGE_VERSION: 4040049/E, 12/2002; PACKING: TUBE; PREFIX: U; RATING: Catalog; RELEASE_DATE: 1464311409; SLEW_RATETYPVUS: 0.55; TOTAL_SUPPLY_VOLTAGEMAX5V_IS_5__5V_IS_10: 16; TOTAL_SUPPLY_VOLTAGEMIN5V_IS_5__5V_IS_10: 4.4; VAULT_GUID: CC2D83C9-2961-4D52-8AD6-81F6368DD5C4; VAULT_REVISION: 132A229D-CFE2-4788-A711-83CB80B27A2B; VIO_25CMAXMV: 2.5
U10 = Texas Instruments - TLC2262CP:TEXAS_INSTRUMENTS_TLC2262CP: TI-TLV_C2XX2_TLC4502-8; CIIVA_IDS: 13615378; CMRR_MIND_B: 70; CODE__JEDEC: MS-001; COMPONENT_LINK_1_DESCRIPTION: Manufacturer URL; COMPONENT_LINK_1_URL: http://www.ti.com/; COMPONENT_LINK_3_DESCRIPTION: Package Specification; COMPONENT_LINK_3_URL: http://www.ti.com/litv/pdf/mpdi001b; DATASHEET: http://www.ti.com/lit/ds/symlink/tlc2262.pdf; DATASHEET_VERSION: SLOS177D; ECO__PLAN: Pb-Free (RoHS); FOOTPRINT_VARIANT_NAME_0: Manufacturer Recommended; GBW_TYP_MHZ: 0.71; IIB_MAXP_A: 100; IMPORTED: yes; IMPORTED_FROM: vault; IMPORT_TS: 1521844264; IQ_PER_CHANNELMAXMA: 0.25; MF: Texas Instruments; MOUNTING_TECHNOLOGY: Through Hole; MPN: TLC2262CP; NUMBER_OF_CHANNELS: 2; OFFSET_DRIFTTYPUVC: 2; PACKAGE: P0008A; PACKAGE_DESCRIPTION: 8-Pin Plastic In-Line, Body 9.59 x 6.35 mm, Pitch 2.54 mm; PACKAGE_VERSION: 4040082/E, 04/2010; PACKING: TUBE; PREFIX: U; RATING: Catalog; RELEASE_DATE: 1464326322; SLEW_RATETYPVUS: 0.55; SUB_FAMILY: Low Power Amp (<=500uA), Precision Amplifier; TOTAL_SUPPLY_VOLTAGEMAX5V_IS_5__5V_IS_10: 16; TOTAL_SUPPLY_VOLTAGEMIN5V_IS_5__5V_IS_10: 4.4; VAULT_GUID: 72ECF672-6631-4BE1-B924-9F2EC9DC95E1; VAULT_REVISION: FFCFF6B7-DEC0-4923-AD0B-2C26D64746E9; VIO_25CMAXMV: 2.5
U11 = ATMEGA328P-AN:ATMEGA328P-AN: ATmega Series 20 MHz 32 KB Flash 2 KB SRAM 8-Bit Microcontroller - TQFP-32; AVAILABILITY: Unavailable; DESCRIPTION: MCU 8-bit ATmega AVR RISC 32KB Flash 2.5V/3.3V/5V 32-Pin TQFP Tray; MF: Microchip; MP: ATMEGA328P-AN; PACKAGE: TQFP-32 Microchip; PRICE: None
U15 = SparkFun-IC-Comms:FT232RL: FT232RL USB UART FT232RL 4th Generation USB UART (USB <-> Serial) Controller. Datasheet <http://www.sparkfun.com/datasheets/IC/FT232R_v104.pdf> SparkFun Products Component <https://www.sparkfun.com/products/650> (COM-00650) SparkFun RedBot Mainboard <https://www.sparkfun.com/products/12097> (ROB-12097) SparkFun FTDI Basic Breakout - 5V <https://www.sparkfun.com/products/9716> (DEV-09716) SparkFun FTDI Basic Breakout - 3.3V <https://www.sparkfun.com/products/9873> (DEV-09873) Bus Pirate - v3.6a <https://www.sparkfun.com/products/12942> (TOL-12942) SparkFun USB to Serial Breakout - FT232RL <https://www.sparkfun.com/products/12731> (BOB-12731) SparkFun PicoBoard <https://www.sparkfun.com/products/11888> (WIG-11888) SparkFun RFID USB Reader <https://www.sparkfun.com/products/9963> (SEN-09963) LilyPad FTDI Basic Breakout - 5V <https://www.sparkfun.com/products/10275> (DEV-10275) SparkFun Stepoko <https://www.sparkfun.com/products/13899> (ROB-13899); PROD_ID: IC-00870
Y1 = 080-20:FOX_ELECTRONICS_FOXSLF-080-20: XTAL-1-2-2; CASE_PACKAGE: TO-263-3; COMPONENT_LINK_1_DESCRIPTION: Manufacturer URL; COMPONENT_LINK_1_URL: http://www.foxonline.com/; DATASHEET: http://download.siliconexpert.com/pdfs/2015/4/5/6/5/7/200/fox_/manual/35607121449963728hc49slf.pdf; DATASHEET_VERSION: Mar-15; DROPOUT_VOLTAGE: 2 V; HEIGHT: 30.02 mm; IMPORTED: yes; IMPORTED_FROM: vault; IMPORT_TS: 1521190278; LENGTH: 10.24 mm; MAX_INPUT_VOLTAGE: 35 V; MAX_OPERATING_TEMPERATURE: 125 degC; MAX_OUPUT_CURRENT: 1 A; MF: Fox Electronics; MIN_INPUT_VOLTAGE: 7 V; MIN_OPERATING_TEMPERATURE: 0 degC; MOUNT: Surface Mount; MPN: FOXSLF/080-20; NOMINAL_OUTPUT_VOLTAGE: 5 V; OUTPUTS: 1; OUTPUT_CURRENT: 1 A; OUTPUT_VOLTAGE: 5 V; PACKAGE: FOXSLF080-20; PACKAGE_DESCRIPTION: 2-Pin Through Hole Device, Body 11.35 x 4.65 mm; PACKAGE_QUANTITY: 50; PACKAGING: Rail/Tube; PINS: 3; PREFIX: Y; RADIATION_HARDENING: No; REACH_SVHC: No SVHC; RO_HSCOMPLIANT: true; VAULT_GUID: 65BF2B40-1F3A-48FE-AAE0-3293605D335B; VAULT_REVISION: 2FABA449-575F-41E0-9224-530642AA36D8; WIDTH: 9.35 mm

## Board
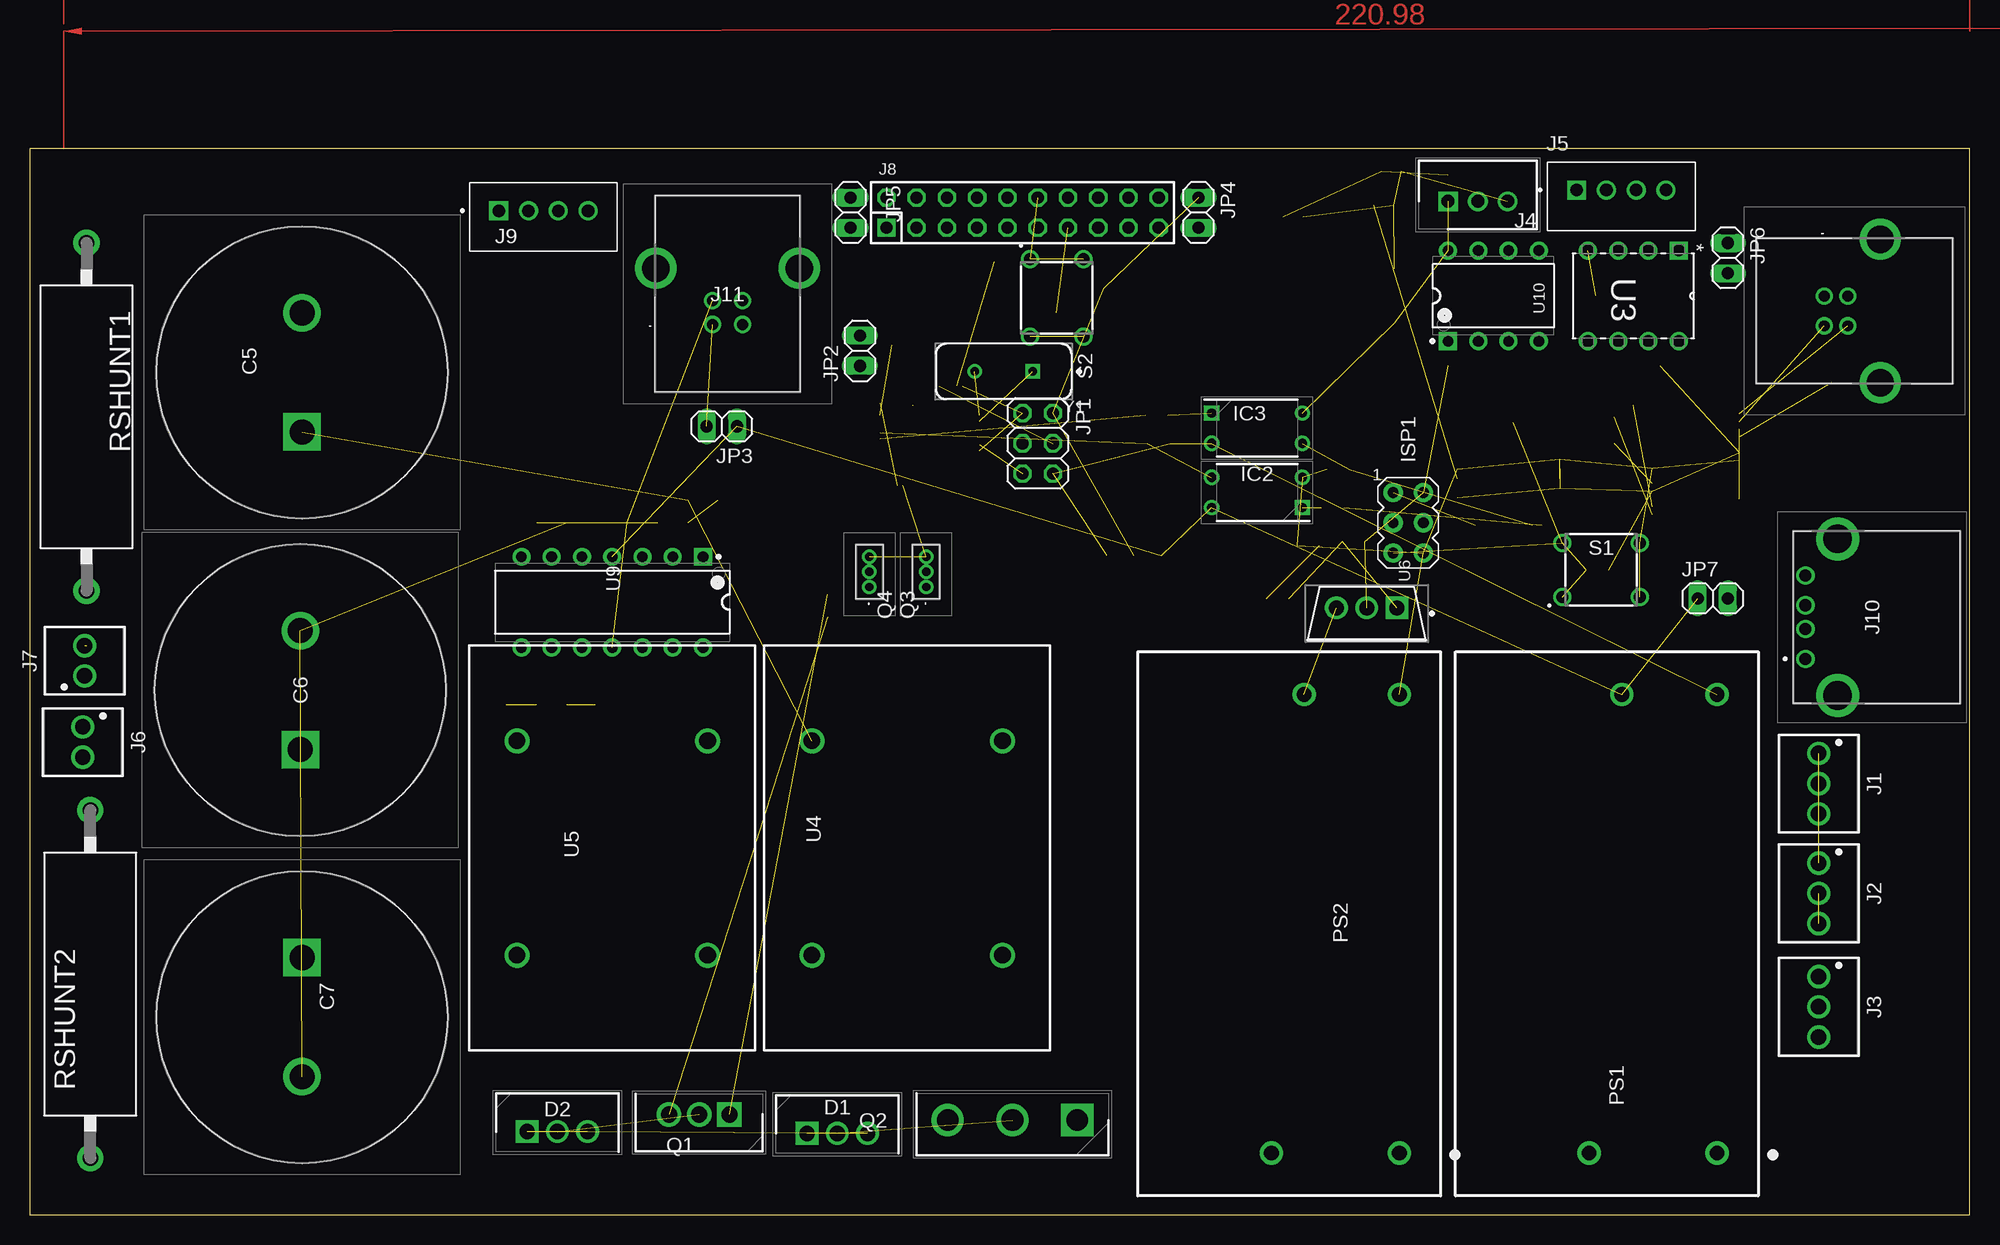
[diagram p5: board, top side]
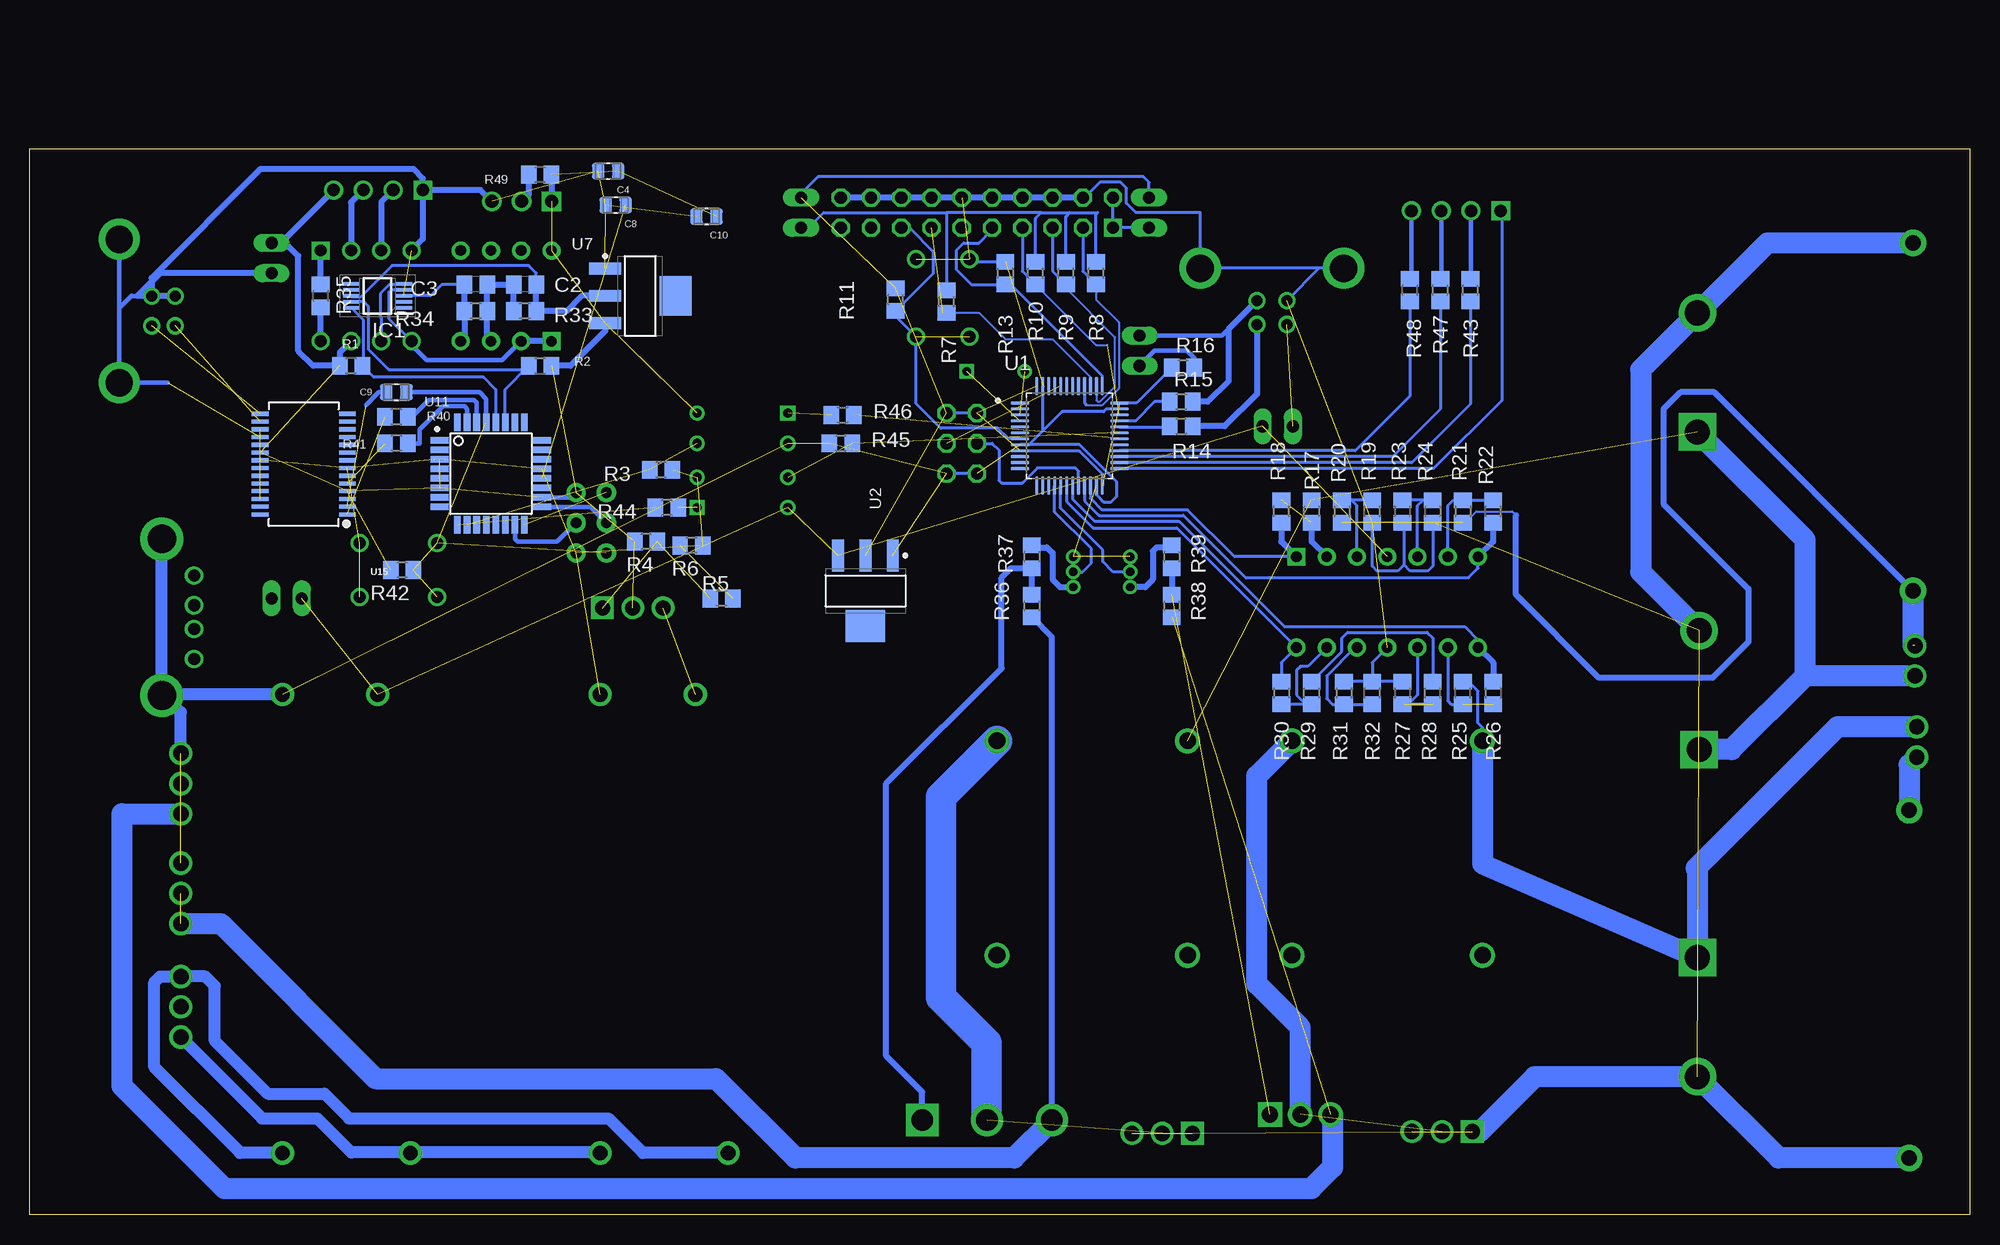
[diagram p6: board, bottom side, seen from below]

Size 162.86 x 89.52 mm. Coordinates in mm from the lower left corner, seen from the top.
Outline: 0,0 162.86,0 162.86,89.52 0,89.52 0,0
Copper layers (1*16): Top 0.035mm / dielectric 1.5mm / Bottom 0.035mm
Design rules "default": minimum track width 6mil, minimum drill 0.35mm, track to track 6mil, track to pad 6mil, pad to pad 6mil, via to via 6mil, smd to smd 6mil, copper to edge 40mil, drill to drill 6mil, minimum pad ring 10mil, minimum via ring 8mil, stop-mask expansion 4mil, vias tented up to drill 0mil, thermal gap 10mil

### Footprints (pad centres in the part's own frame; a part is rotated, then mirrored left to right if it is on the bottom)
C0805 = smd 1.3 x 1.5: 1 -0.95,0; 2 0.95,0
CAP_0805 = smd 1.05 x 1.38: 1 -0.84,0; 2 0.84,0
SLPX102M200C4P3 = drill 2.1 pad 3.15 square: 1 0,0 | drill 2.1 pad 3.15: 2 10,0
TO254P490X1000X2143-3P = drill 1.28 pad 1.92 square: 1 0,0 | drill 1.28 pad 1.92: 2 2.54,0; 3 5.08,0
EAT22051E = drill 2.67 pad 4.005: 1 -12.7,0; 2 12.7,0
SOP50P490X110-10N = smd 1.4 x 0.3: 1 -2.2,1; 2 -2.2,0.5; 3 -2.2,0; 4 -2.2,-0.5; 5 -2.2,-1; 6 2.2,-1; 7 2.2,-0.5; 8 2.2,0; 9 2.2,0.5; 10 2.2,1
DIP762W58P254L450H584Q4N = drill 0.78 pad 1.18 square: 1 -3.81,1.27 | drill 0.78 pad 1.18: 2 -3.81,-1.27; 3 3.81,-1.27; 4 3.81,1.27
AVRISP = drill 0.9 pad 1.626: 1 -1.27,2.54; 2 1.27,2.54; 3 -1.27,0; 4 1.27,0; 5 -1.27,-2.54; 6 1.27,-2.54
691210910003 = drill 1.3: 1 -2.54,0; 2 0,0; 3 2.54,0
SHDR3W64P0X250_1X3_990X575X700 = drill 1.1 pad 1.65 square: 1 0,0 | drill 1.1 pad 1.65: 2 2.5,0; 3 5,0
JST_B4B-XH-A(LF)(SN) = drill 1.06 square: 1 0,0 | drill 1.06: 2 2.5,0; 3 5,0; 4 7.5,0
691210910002 = drill 1.3: 1 -1.27,0; 2 1.27,0
JTAG-20 = drill 1.016 square: 1 -11.43,-1.27 | drill 1.016 octagon: 2 -11.43,1.27; 3 -8.89,-1.27; 4 -8.89,1.27; 5 -6.35,-1.27; 6 -6.35,1.27; 7 -3.81,-1.27; 8 -3.81,1.27; 9 -1.27,-1.27; 10 -1.27,1.27; 11 1.27,-1.27; 12 1.27,1.27; 13 3.81,-1.27; 14 3.81,1.27; 15 6.35,-1.27; 16 6.35,1.27; 17 8.89,-1.27; 18 8.89,1.27; 19 11.43,-1.27; 20 11.43,1.27
SS52100001 = drill 1.02 pad 1.53: 1 0,0; 2 2.5,0; 3 4.5,0; 4 7,0 | drill 2.4 pad 3.6: MH1 -3.07,-2.71; MH2 10.07,-2.71
UJ2BH1TH = drill 0.92 pad 1.431: 1 1.25,10.81; 2 -1.25,10.81; 3 -1.25,8.81; 4 1.25,8.81 | drill 2.3 pad 3.45: MH1 -6.02,6.1; MH2 6.02,6.1
2X03 = drill 1.016 octagon: 1 -2.54,-1.27; 2 -2.54,1.27; 3 0,-1.27; 4 0,1.27; 5 2.54,-1.27; 6 2.54,1.27
1X02 = drill 1.016 long: 1 -1.27,0; 2 1.27,0
IRM-10 = drill 1.24 pad 1.95: 1 3.6,3.45; 2 42.1,3.45; 3 42.1,11.45; 4 3.6,14.2
TO254P483X1028X1700-3P = drill 1.36 pad 2.04 square: 1 0,0 | drill 1.36 pad 2.04: 2 2.54,0; 3 5.08,0
TO545P521X1594X2566-3P = drill 1.81 pad 2.715 square: 1 0,0 | drill 1.81 pad 2.715: 2 5.45,0; 3 10.9,0
ZTX458 = drill 0.7 pad 1.1: 1 0,0; 2 1.27,0; 3 2.54,0
R0805 = smd 1.3 x 1.5: 1 -0.95,0; 2 0.95,0
RS05_69-70 = drill 1.3 pad 2.2: 1 -14.605,0; 2 14.605,0
1825910-6 = drill 1 pad 1.5: 1 3.25,2.25; 2 3.25,-2.25; 3 -3.25,2.25; 4 -3.25,-2.25
QFP50P900X900X160-48N = smd 1.56 x 0.28: 1 -4.18,2.75; 2 -4.18,2.25; 3 -4.18,1.75; 4 -4.18,1.25; 5 -4.18,0.75; 6 -4.18,0.25; 7 -4.18,-0.25; 8 -4.18,-0.75; 9 -4.18,-1.25; 10 -4.18,-1.75; 11 -4.18,-2.25; 12 -4.18,-2.75; 25 4.18,-2.75; 26 4.18,-2.25; 27 4.18,-1.75; 28 4.18,-1.25; 29 4.18,-0.75; 30 4.18,-0.25; 31 4.18,0.25; 32 4.18,0.75; 33 4.18,1.25; 34 4.18,1.75; 35 4.18,2.25; 36 4.18,2.75 | smd 0.28 x 1.56: 13 -2.75,-4.18; 14 -2.25,-4.18; 15 -1.75,-4.18; 16 -1.25,-4.18; 17 -0.75,-4.18; 18 -0.25,-4.18; 19 0.25,-4.18; 20 0.75,-4.18; 21 1.25,-4.18; 22 1.75,-4.18; 23 2.25,-4.18; 24 2.75,-4.18; 37 2.75,4.18; 38 2.25,4.18; 39 1.75,4.18; 40 1.25,4.18; 41 0.75,4.18; 42 0.25,4.18; 43 -0.25,4.18; 44 -0.75,4.18; 45 -1.25,4.18; 46 -1.75,4.18; 47 -2.25,4.18; 48 -2.75,4.18
NATIONAL_SEMICONDUCTOR_LM1117IMPX-3.3-NOPB_2 = smd 2.7 x 1: 1 -2.95,2.3; 2 -2.95,0; 3 -2.95,-2.3 | smd 2.7 x 3.3: 4 2.95,0
DIP254P762X533-8 = drill 0.991 square: 1 -7.62,7.62 | drill 0.991: 2 -7.62,5.08; 3 -7.62,2.54; 4 -7.62,0; 5 0,0; 6 0,2.54; 7 0,5.08; 8 0,7.62
SC-10-30J = drill 1.4 pad 2.1: 1 -9,-8; 2 9,-8; 3 9,8; 4 -9,8
ON_SEMI_LM317BTG_0 = drill 1.25 pad 1.9 square: 1 -0.467,2.54 | drill 1.25 pad 1.9: 2 -0.467,0; 3 -0.467,-2.54
TEXAS_INSTRUMENTS_TLC2264CN_0 = drill 0.9 pad 1.5 square: 1 -3.81,7.62 | drill 0.9 pad 1.5: 2 -3.81,5.08; 3 -3.81,2.54; 4 -3.81,0; 5 -3.81,-2.54; 6 -3.81,-5.08; 7 -3.81,-7.62; 8 3.81,-7.62; 9 3.81,-5.08; 10 3.81,-2.54; 11 3.81,0; 12 3.81,2.54; 13 3.81,5.08; 14 3.81,7.62
TEXAS_INSTRUMENTS_TLC2262CP_0 = drill 0.9 pad 1.5 square: 1 -3.81,3.81 | drill 0.9 pad 1.5: 2 -3.81,1.27; 3 -3.81,-1.27; 4 -3.81,-3.81; 5 3.81,-3.81; 6 3.81,-1.27; 7 3.81,1.27; 8 3.81,3.81
QFP80P900X900X120-32N = smd 1.5 x 0.55: 1 -4.3,2.8; 2 -4.3,2; 3 -4.3,1.2; 4 -4.3,0.4; 5 -4.3,-0.4; 6 -4.3,-1.2; 7 -4.3,-2; 8 -4.3,-2.8; 17 4.3,-2.8; 18 4.3,-2; 19 4.3,-1.2; 20 4.3,-0.4; 21 4.3,0.4; 22 4.3,1.2; 23 4.3,2; 24 4.3,2.8 | smd 0.55 x 1.5: 9 -2.8,-4.3; 10 -2,-4.3; 11 -1.2,-4.3; 12 -0.4,-4.3; 13 0.4,-4.3; 14 1.2,-4.3; 15 2,-4.3; 16 2.8,-4.3; 25 2.8,4.3; 26 2,4.3; 27 1.2,4.3; 28 0.4,4.3; 29 -0.4,4.3; 30 -1.2,4.3; 31 -2,4.3; 32 -2.8,4.3
SSOP28DB = smd 0.348 x 1.397: 1 -4.225,-3.656; 2 -3.575,-3.656; 3 -2.925,-3.656; 4 -2.275,-3.656; 5 -1.625,-3.656; 6 -0.975,-3.656; 7 -0.325,-3.656; 8 0.325,-3.656; 9 0.975,-3.656; 10 1.625,-3.656; 11 2.275,-3.656; 12 2.925,-3.656; 13 3.575,-3.656; 14 4.225,-3.656; 15 4.225,3.656; 16 3.575,3.656; 17 2.925,3.656; 18 2.275,3.656; 19 1.625,3.656; 20 0.975,3.656; 21 0.325,3.656; 22 -0.325,3.656; 23 -0.975,3.656; 24 -1.625,3.656; 25 -2.275,3.656; 26 -2.925,3.656; 27 -3.575,3.656; 28 -4.225,3.656
FOX_ELECTRONICS_FOXSLF-080-20_0 = drill 0.7 pad 1.2 square: 1 -2.44,0 | drill 0.7 pad 1.2: 2 2.44,0

### Placement (x,y rotation side)
C2  121.28,78.11 180 bottom
C3  125.41,78.11 180 bottom
C4  114.3,87.63 180 bottom
C5  22.86,65.72 90 top
C6  22.7,39.05 90 top
C7  22.86,21.59 270 top
C8  113.67,84.77 180 bottom
C9  132.08,69.06 180 bottom
C10  106.05,83.82 180 bottom
D1  65.25,6.83 0 top
D2  41.75,6.99 0 top
H1  93.34,-11.75 180 top  (outside the outline)
H2  47.62,-16.83 0 top  (outside the outline)
IC1  133.67,77.15 180 bottom
IC2  103.03,60.64 180 top
IC3  103.03,66.04 0 top
ISP1  115.73,58.1 0 top
J1  150.18,36.2 270 top
J2  150.18,26.99 270 top
J3  150.18,17.46 270 top
J4  119.06,85.09 0 top
J5  129.86,86.04 0 top
J6  4.45,39.69 270 top
J7  4.6,46.51 90 top
J8  83.34,84.14 0 top
J9  39.37,84.3 0 top
J10  149.07,46.67 90 top
J11  58.58,85.57 180 top
J12  161.45,75.88 90 top
JP1  84.61,64.77 270 top
JP2  69.69,72.55 90 top
JP3  58.1,66.2 180 top
JP4  98.11,84.14 270 top
JP5  68.9,84.14 270 top
JP6  142.56,80.33 270 top
JP7  141.29,51.75 0 top
PS1  145.1,1.59 90 top
PS2  118.43,1.59 90 top
Q1  58.74,8.41 180 top
Q2  87.95,7.94 180 top
Q3  75.25,52.7 90 top
Q4  70.48,52.7 90 top
R1  135.89,71.28 180 bottom
R2  120.02,71.28 0 bottom
R3  109.86,62.55 180 bottom
R4  111.12,56.52 180 bottom
R5  104.78,51.75 180 bottom
R6  107.31,56.2 180 bottom
R7  85.88,76.68 90 bottom
R8  73.34,79.06 90 bottom
R9  75.88,79.06 90 bottom
R10  78.42,79.06 90 bottom
R11  90.17,76.83 90 bottom
R13  80.96,79.06 270 bottom
R14  66.2,66.2 0 bottom
R15  66.2,68.26 0 bottom
R16  66.04,71.12 0 bottom
R17  55.25,59.05 90 bottom
R18  57.79,59.05 90 bottom
R19  50.16,59.05 90 bottom
R20  52.7,59.05 270 bottom
R21  42.55,59.05 270 bottom
R22  40.01,59.05 90 bottom
R23  47.62,59.05 270 bottom
R24  45.09,59.05 270 bottom
R25  42.55,43.81 90 bottom
R26  40.01,43.81 270 bottom
R27  47.62,43.81 270 bottom
R28  45.09,43.81 90 bottom
R29  55.25,43.81 90 bottom
R30  57.79,43.81 270 bottom
R31  52.55,43.81 270 bottom
R32  50.16,43.81 90 bottom
R33  121.28,75.88 180 bottom
R34  125.41,75.88 180 bottom
R35  138.43,77.15 90 bottom
R36  78.74,51.12 270 bottom
R37  78.74,55.24 270 bottom
R38  66.99,51.12 270 bottom
R39  66.99,55.24 270 bottom
R40  132.08,66.99 180 bottom
R41  132.08,64.77 180 bottom
R42  131.6,54.13 180 bottom
R43  41.91,77.63 90 bottom
R44  109.38,59.37 180 bottom
R45  94.77,64.77 0 bottom
R46  94.61,67.15 0 bottom
R47  44.45,77.63 90 bottom
R48  46.99,77.63 90 bottom
R49  120.02,87.31 180 bottom
RSHUNT1  4.76,66.99 270 top
RSHUNT2  5.08,19.37 90 top
S1  131.92,54.13 180 top
S2  86.2,76.99 90 top
U1  75.56,65.41 0 bottom
U2  92.71,52.39 270 bottom
U3  130.81,73.34 270 top
U4  73.66,30.8 270 top
U5  48.9,30.8 270 top
U6  112.24,50.48 270 top
U7  111.6,77.15 0 bottom
U9  48.9,51.44 270 top
U10  122.87,77.15 90 top
U11  124.14,62.23 0 bottom
U15  139.86,63.02 90 bottom
Y1  81.76,70.8 180 top

### Tracks (layer width: path | path; a pad name or v marks a point on that pad's centre or on a via)
1V65
  Bottom 0.254: IC1.4 132.53,77.65 132.71,77.47 132.71,75.25 U3.5
  Bottom 0.381: U10.2 123.19,71.75 129.54,71.75 130.81,73.03 U3.5
  Bottom 0.508: U10.1 U10.2
3V3_D
  Bottom 0.254: IC1.8 135.8,77.08 135.05,77.08 132.44,79.69 120.97,79.69 120.34,79.06 C2.1
  Bottom 0.508: C2.1 R33.1 117.79,75.88 116.53,77.15 U7.2
3V3_FTDI  (1 unrouted)
5V_D  (14 unrouted)
  Bottom 0.381: ISP1.2 117.41,60.23 U11.18
  Bottom 0.508: J5.4 141.8,81.6 JP6.1 141.41,81.6 140.31,80.49 140.31,72.52 139.07,71.28 R1.2 136.84,72.39 U3.7 | R49.1 J4.1 | U7.3 114.55,74.2 117.48,71.28 R2.2
12V_D  (1 unrouted)
230V_N
  Bottom 1.016: PS1.4 130.95,5.24 | J3.3 143.35,8.1 138.73,8.1 135.87,5.24 130.95,5.24 | PS2.1 115.03,5.24 130.95,5.24
230V_P
  Bottom 1.016: 150.02,20 J3.1 | PS2.4 111.37,5.19 114.28,8.1 136.05,8.1 138.11,10.16 142.88,10.16 147.32,14.61 147.32,19.21 148.11,20 J3.1 | PS1.1 145.2,5.19 152.4,12.38 152.4,19.53 151.92,20 J3.1
+3V3  (6 unrouted)
  Bottom 0.254: R16.1 69.95,68.16 U1.36 | JP5.1 68.9,86.68 69.37,87.15 96.68,87.15 98.11,85.72 JP4.1 | JP1.1 JP1.2 | U1.9 74.79,64.16 72.81,62.18 U1.24
+5V  (5 unrouted)
BOOT0  (1 unrouted)
BOOT1
  Bottom 0.254: U1.20 74.81,62.43 75.09,62.71 78.26,62.71 79.53,61.44 81.28,61.44 81.51,61.66 81.51,64.2 82.07,64.77 JP1.3
GND  (18 unrouted)
  Bottom 0.152: 77.79,69.61 U1.47
  Bottom 0.254: J11.4 54.62,79.47 J11.MH2 J11.MH1 64.6,84.14 70.01,84.14 70.8,84.93 70.8,86.2 71.28,86.68 73.03,86.68 74.3,85.41 J8.4 | S2.1 83.72,80.01 R13.1 | JP1.5 JP1.6 | 77.79,65.84 78.97,64.66 U1.8 74.72,64.66 71.6,61.53 71.6,60.33 72.07,59.85 72.71,59.85 73.02,60.17 73.03,60.17 73.31,60.45 U1.23 | U1.47 77.79,69.56 77.79,65.84 | U1.35 72.49,67.66 72.72,67.43 76.2,67.43 77.79,65.84 | R24.2 45.08,54.45 45.47,54.06 46.99,54.06 47.47,54.54 47.47,54.61 | R23.2 47.47,57.95 47.47,54.61 | 47.47,54.61 48.01,54.06 49.78,54.06 50.16,54.45 R19.1 | U9.11 50.16,46.35 R32.2 | R27.1 R32.2 | R32.2 R31.1
  Bottom 0.508: J8.4 J8.6 J8.8 J8.12 | J8.10 J8.12 | J8.12 J8.16 | J8.14 J8.16 | J8.16 J8.18 J8.20
  Bottom 1.016: PS1.2 151.69,43.69 | 151.69,43.69 J10.MH1 J10.MH2 | J1.1 150.18,42.17 151.69,43.69
  Bottom 1.778: D2.1 41.12,6.99 36.51,11.59 C7.2 16.03,4.76 RSHUNT2.1 | RSHUNT1.1 16.98,81.6 C5.2 27.62,70.96 27.62,53.97 C6.2
GND_BRK
  Bottom 0.254: R29.2 54.38,45.63 52.7,47.31 52.7,48.42 52.23,48.9 45.56,48.9 45.08,48.42 R28.2
GND_D  (20 unrouted)
  Bottom 0.254: C3.2 128.27,78.11 129.22,77.15 IC1.3
  Bottom 0.381: 151.29,69.85 J12.MH1 155.35,76.11 | J12.4 154.29,77.13 154.3,77.15 155.35,76.11 | J12.MH2 155.35,76.11
  Bottom 0.508: U10.4 126.36,73.66 R34.2 C3.2 | U3.4 129.86,81.92 J5.1 | J4.3 125.01,86.04 J5.1 | J5.1 129.86,87 130.65,87.79 143.51,87.79 152.64,78.66 J12.4
GND_MOT  (2 unrouted)
  Bottom 0.152: R21.2 42.38,58.1 41.43,59.05 38.42,59.05 38.1,58.74
  Bottom 0.508: RSHUNT1.2 21.43,69.06 24.29,69.06 25.72,67.63 25.72,59.69 18.57,52.55 18.57,48.1 21.59,45.09 31.12,45.09 38.1,52.07 38.1,58.74
  Bottom 1.778: RSHUNT1.2 4.76,47.78
IN_100V_BRAKE  (2 unrouted)
  Bottom 1.778: Q1.3 53.5,8.26 53.5,3.97 55.25,2.22 146.53,2.22 155.1,10.79 155.1,33.66 J1.3
IN_100V_MOTOR  (1 unrouted)
  Bottom 0.508: Q2.3 77.05,48.48 R36.2
  Bottom 1.778: Q2.3 80.22,4.76 98.58,4.76 105.25,11.43 133.83,11.43 146.84,24.45 J2.3
JNTRST  (1 unrouted)
  Bottom 0.152: R8.1 73.34,76.83 71.44,74.93 71.44,69.37 72.87,67.94 74.14,67.94
  Bottom 0.254: J8.3 74.45,79.22 R8.1 | U1.40 74.31,68.17 74.14,68
JTCK
  Bottom 0.254: J8.9 82.07,82.71 83.19,81.6 84.45,81.6 85.09,80.96 85.09,79.38 83.82,78.11 R13.2 80.49,78.11 72.81,70.43 U1.37
JTDI
  Bottom 0.152: R9.1 75.88,77.79 71.75,73.66 71.75,69.53 73.03,68.26 73.18,68.26 73.31,68.39 U1.38
  Bottom 0.254: J8.5 76.99,79.22 R9.1
JTDO  (1 unrouted)
  Bottom 0.152: R7.1 83.19,75.73 80.96,73.5 76.99,73.5 73.81,70.32 U1.39
  Bottom 0.254: 86.2,75.73 R7.1
JTMS  (1 unrouted)
  Bottom 0.152: R10.1 73.34,73.03 72.39,73.03
  Bottom 0.254: J8.7 79.53,79.22 R10.1
LOAD_CELL_NEG
  Bottom 0.508: J5.3 135.89,85.01 U3.2
LOAD_CELL_POS
  Bottom 0.508: J5.2 133.35,85.05 U3.3
MES_I_BRAKE
  Bottom 0.254: U1.18 75.81,59.89 73.59,57.67 66.56,57.67 U9.14 57.79,46.35 R30.1
MES_I_MOTOR
  Bottom 0.254: U1.21 74.31,59.93 73.1,58.71 66.01,58.71 60.8,53.5 42.07,53.5 41.27,54.29 U9.7
  Bottom 0.508: U9.7 40.01,56.52 R22.1
MES_LOAD_CELL
  Bottom 0.254: IC1.5 131.54,78.08 132.68,78.08 133.44,77.32 133.44,75.4 133.35,75.31 U3.6
MES_U_BRAKE
  Bottom 0.254: U1.19 75.31,60.08 73.48,58.24 66.39,58.24 57.53,49.37 42.39,49.37 41.27,48.26 U9.8
  Bottom 0.508: U9.8 40.01,46.35 R26.1
MES_U_MOTOR
  Bottom 0.254: U9.1 61.71,55.24 65.65,59.19 72.84,59.19 73.81,60.16 U1.22
  Bottom 0.508: R18.1 57.79,56.52 U9.1
MISO_ATM  (1 unrouted)
MOSI_ATM
  Bottom 0.381: U11.15 122.12,57.91 122.12,56.72 121.92,56.52 118.58,56.52 ISP1.4
N$1  (1 unrouted)
  Bottom 2.54: Q2.2 82.55,7.99 82.55,14.45 86.36,18.26 86.36,35.1 U4.4
N$3  (1 unrouted)
N$5  (2 unrouted)
N$6
  Bottom 0.508: J11.2 59.83,68.92 62.55,66.2 R14.2
N$7
  Bottom 0.381: JP2.2 62.77,73.82 62.23,74.36
  Bottom 0.508: J11.3 62.23,74.36 62.23,70.01 63.98,68.26 R15.2
N$8
  Bottom 0.381: R16.2 65.09,71.92 65.72,72.55 68.42,72.55 JP2.1
N$9
  Bottom 1.778: J6.2 5.08,37.78 RSHUNT2.2
N$10
  Bottom 0.508: Q2.1 87.95,10.32 90.96,13.34 90.96,36.2 81.28,45.88 81.28,53.5 80.48,54.3 R37.2 R36.1
N$11
  Bottom 0.508: R37.1 78.58,56.04 77.47,56.04 76.99,55.56 76.99,53.34 76.36,52.7 Q3.1
N$12  (1 unrouted)
  Bottom 0.508: R17.1 55.25,56.52 U9.2
N$13
  Bottom 0.254: U9.3 51.44,59.53 51.91,60.01 R20.1 R19.2
N$14  (1 unrouted)
  Bottom 0.381: 134.62,68 133.55,69.06 C9.2
N$15  (1 unrouted)
N$16  (1 unrouted)
  Bottom 0.508: R39.2 R38.1
N$17
  Bottom 0.254: U9.6 43.82,59.53 43.34,60.01 R21.1 R22.2
N$18
  Bottom 0.254: R24.1 45.88,60.01 | 45.88,60.01 R23.1 | U9.5 46.36,59.53 45.88,60.01
N$19  (1 unrouted)
  Bottom 0.254: U9.10 46.36,43.66 47.15,42.87 R28.1 | R27.2 47.55,42.94 47.47,42.87
N$20  (1 unrouted)
  Bottom 0.254: U9.9 43.82,43.18 43.5,42.86 R25.1
N$21
  Bottom 0.254: R29.1 55.72,42.87 | 55.72,42.87 R30.2 | U9.13 55.56,46.04 56.2,46.04 56.51,45.72 56.51,43.66 55.72,42.87
N$22
  Bottom 0.508: R39.1 67.15,56.04 68.26,56.04 68.58,55.72 68.58,53.34 69.22,52.7 Q4.1
N$23
  Bottom 0.254: U9.12 51.59,47.62 53.97,45.24 53.97,43.34 53.5,42.87 R31.2 R32.1
N$25  (1 unrouted)
N$26
  Bottom 0.508: R35.2 U3.1
N$27
  Bottom 0.508: U10.3 124.46,73.66 R34.1 C3.1 C2.2 R33.2
N$28
  Bottom 0.508: U3.8 R35.1
N$29  (1 unrouted)
N$32  (1 unrouted)
  Bottom 1.778: Q1.2 56.2,15.72 59.85,19.37 59.85,36.84 U5.4
N$34  (1 unrouted)
N$35  (1 unrouted)
N$36  (1 unrouted)
N$37
  Bottom 0.254: J8.2 J8.1 JP5.2
N$38
  Bottom 0.254: 77.95,84.14 75.56,84.14 | 75.56,84.14 73.18,84.14 73.34,83.98 R8.2 73.34,80.64 | R9.2 75.88,83.82 75.56,84.14 | R10.2 78.42,83.66 77.95,84.14 | 85.88,84.14 R7.2 | JP4.2 97.47,82.87 96.2,84.14 85.88,84.14 | 77.95,84.14 85.88,84.14
N$39
  Bottom 0.508: JP6.2 151.89,79.06 153.8,77.15 150.66,77.15 J12.1
N$40
  Bottom 0.381: J9.2 41.87,78.62 R43.2
N$41
  Bottom 0.381: J9.3 44.37,78.66 R47.2
N$42
  Bottom 0.381: J9.4 46.87,78.7 R48.2
N$43  (1 unrouted)
N$44  (1 unrouted)
NRST  (1 unrouted)
  Bottom 0.254: U1.7 80.71,65.16 81.6,66.04 86.39,66.04 88.45,68.11 S2.4 90.09,75.38 90.09,75.96 | J8.15 89.01,82.87 87.02,80.88 87.02,79.03 90.09,75.96 | 90.09,75.96 R11.1
PWM_BRAKE
  Bottom 0.254: Q4.2 71.91,53.98 72.78,54.84 72.78,55.8 76.31,59.34 U1.17
PWM_MOTOR
  Bottom 0.254: Q3.2 74.47,53.98 73.73,54.72 73.73,55.93 76.81,59.01 U1.16
RST_ATM  (4 unrouted)
  Bottom 0.381: U11.29 124.54,68.5 125.09,69.06 C9.1
  Bottom 0.508: C9.1 131.18,69.11
RX0_ATM
  Bottom 0.381: U11.30 125.34,68.19 125.57,68.42 129.38,68.42 130.81,66.99 R40.1
RX_ATM  (2 unrouted)
RX_FTDI  (1 unrouted)
SCK_ATM
  Bottom 0.381: U11.17 115.79,59.43 ISP1.3
SCL
  Bottom 0.254: IC1.10 134.85,75.14 134.85,71.36 R1.1 133.99,70.33 124.78,70.33 123.74,69.29 U11.28
SDA
  Bottom 0.254: IC1.9 134.8,76.65 134.43,76.28 134.43,72.68 132.71,70.96 121.28,70.96 R2.1 122.94,69.3 U11.27
SPEED_SENSOR_DATA
  Bottom 0.508: R49.2 120.97,85.69 J4.2
STM_MISO
  Bottom 0.254: R47.1 44.45,67.63 48.42,63.66 U1.27
STM_MOSI
  Bottom 0.254: R48.1 46.99,68.74 51.57,64.16 U1.28
STM_NSS
  Bottom 0.254: J9.1 39.29,84.22 39.29,68.37 45.01,62.66 U1.25
STM_RX  (2 unrouted)
STM_SCK
  Bottom 0.254: U1.26 46.83,63.16 41.91,68.08 R43.1
STM_TX  (1 unrouted)
TX0_ATM
  Bottom 0.381: U11.31 126.14,67.67 126.36,67.89 128.17,67.89 130.14,65.92 130.14,64.77 R41.1
TX_ATM  (1 unrouted)
TX_FTDI  (1 unrouted)
  Bottom 0.381: R40.2
USBDM
  Bottom 0.254: U1.32 67.19,66.16 R14.1
USBDP
  Bottom 0.254: R15.1 68.42,68.26 70.03,66.66 U1.33
V_BRK
  Bottom 0.254: U5.1 40.9,40.9 41.27,41.27 41.27,43.97 42.07,44.77 R25.2
  Bottom 1.778: U5.1 40.9,29.46 C7.1 22.86,29.08 22.99,29.09 11.11,40.96 J6.1
V_MOT  (2 unrouted)
  Bottom 1.778: J7.1 13.81,45.24 | C6.1 20,39.05 13.81,45.24 | 13.81,45.24 13.81,56.67 C5.1
(copper drawn outside any net)
  shapes: Top area x3